# EAGLE design 519_jetson_nano_030001 (EAGLE 9.6.2)
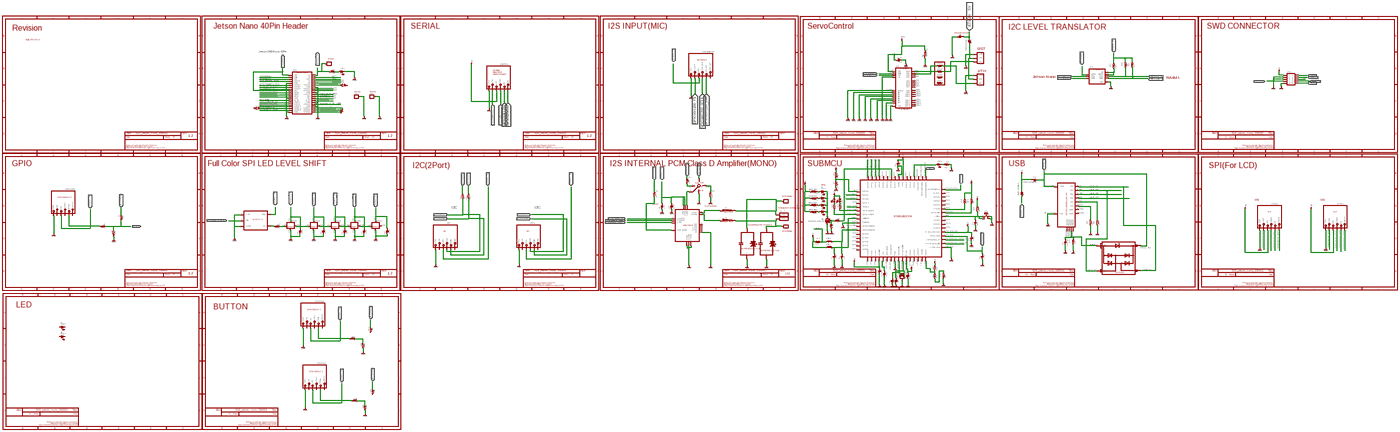
[diagram p0: schematic, sheet 1, overview]
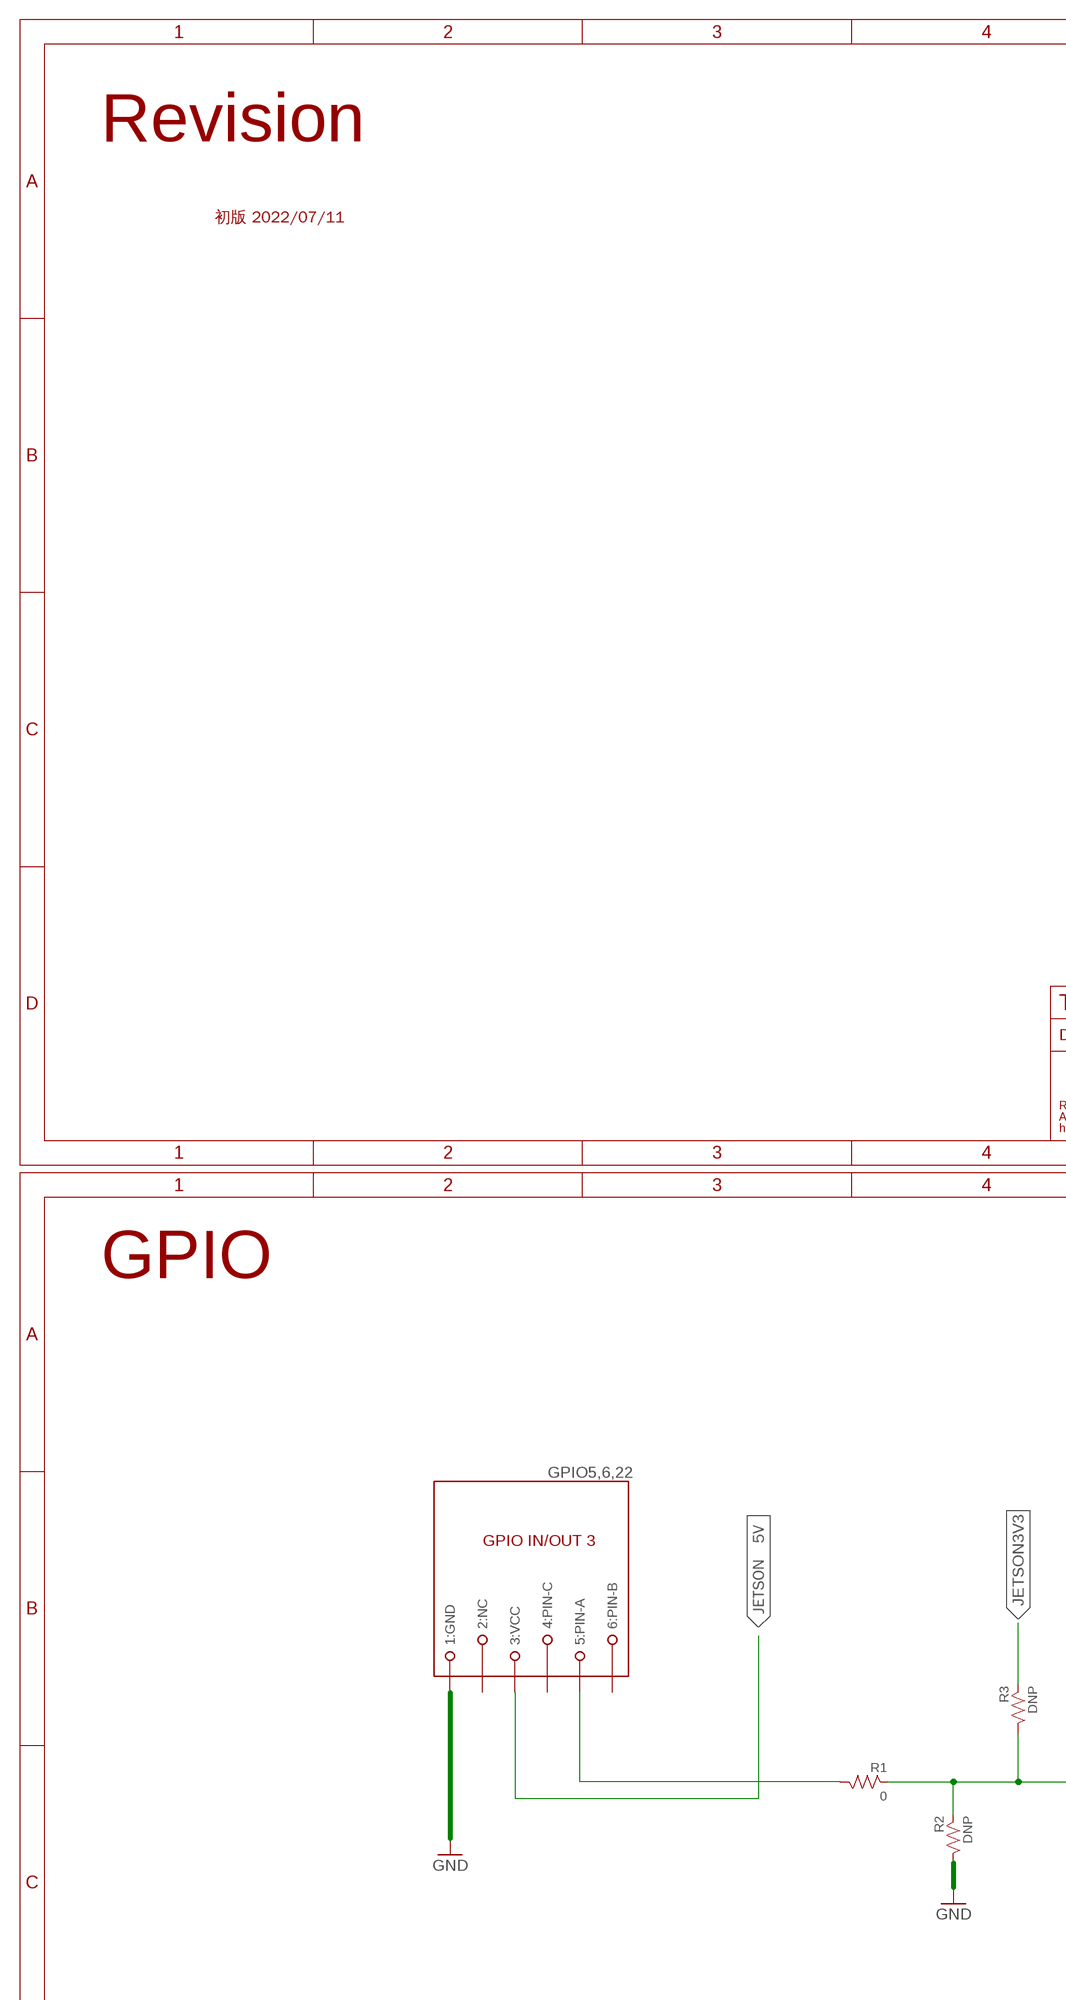
[diagram p1: schematic, sheet 1, part 1 of 8]
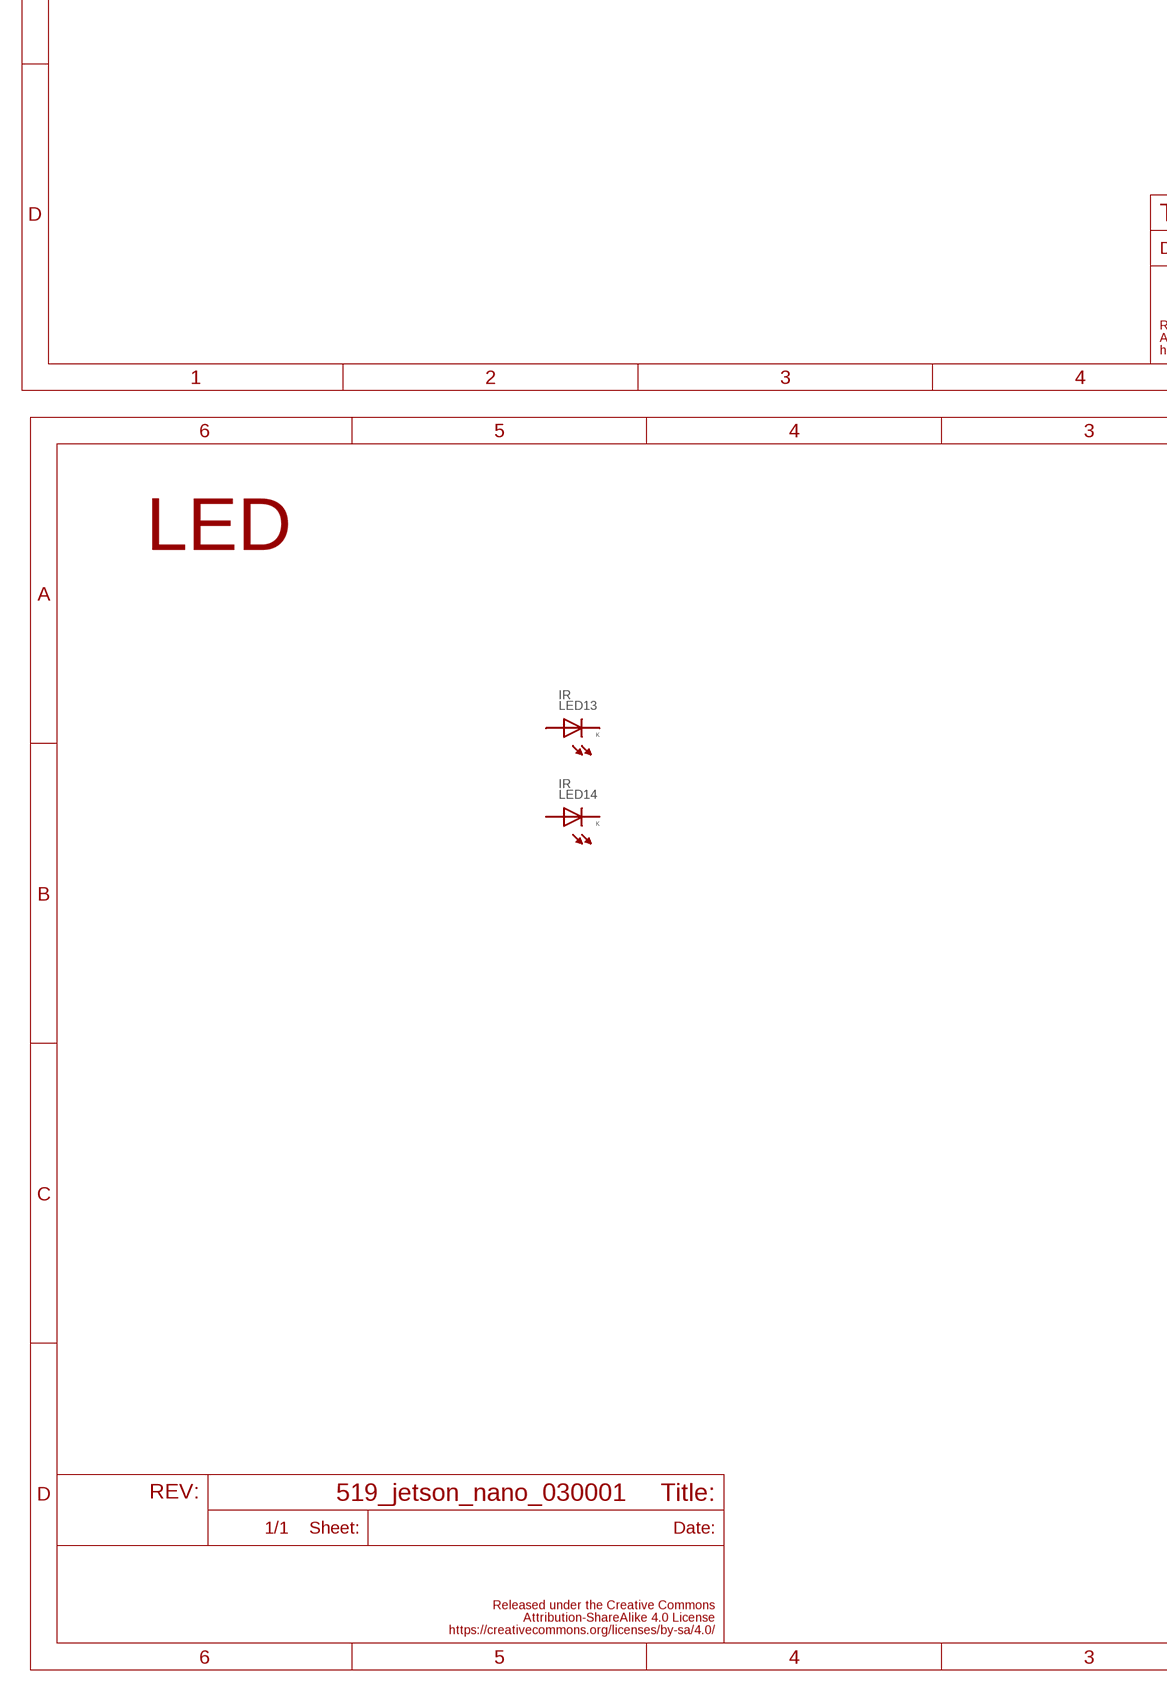
[diagram p2: schematic, sheet 1, part 2 of 8]
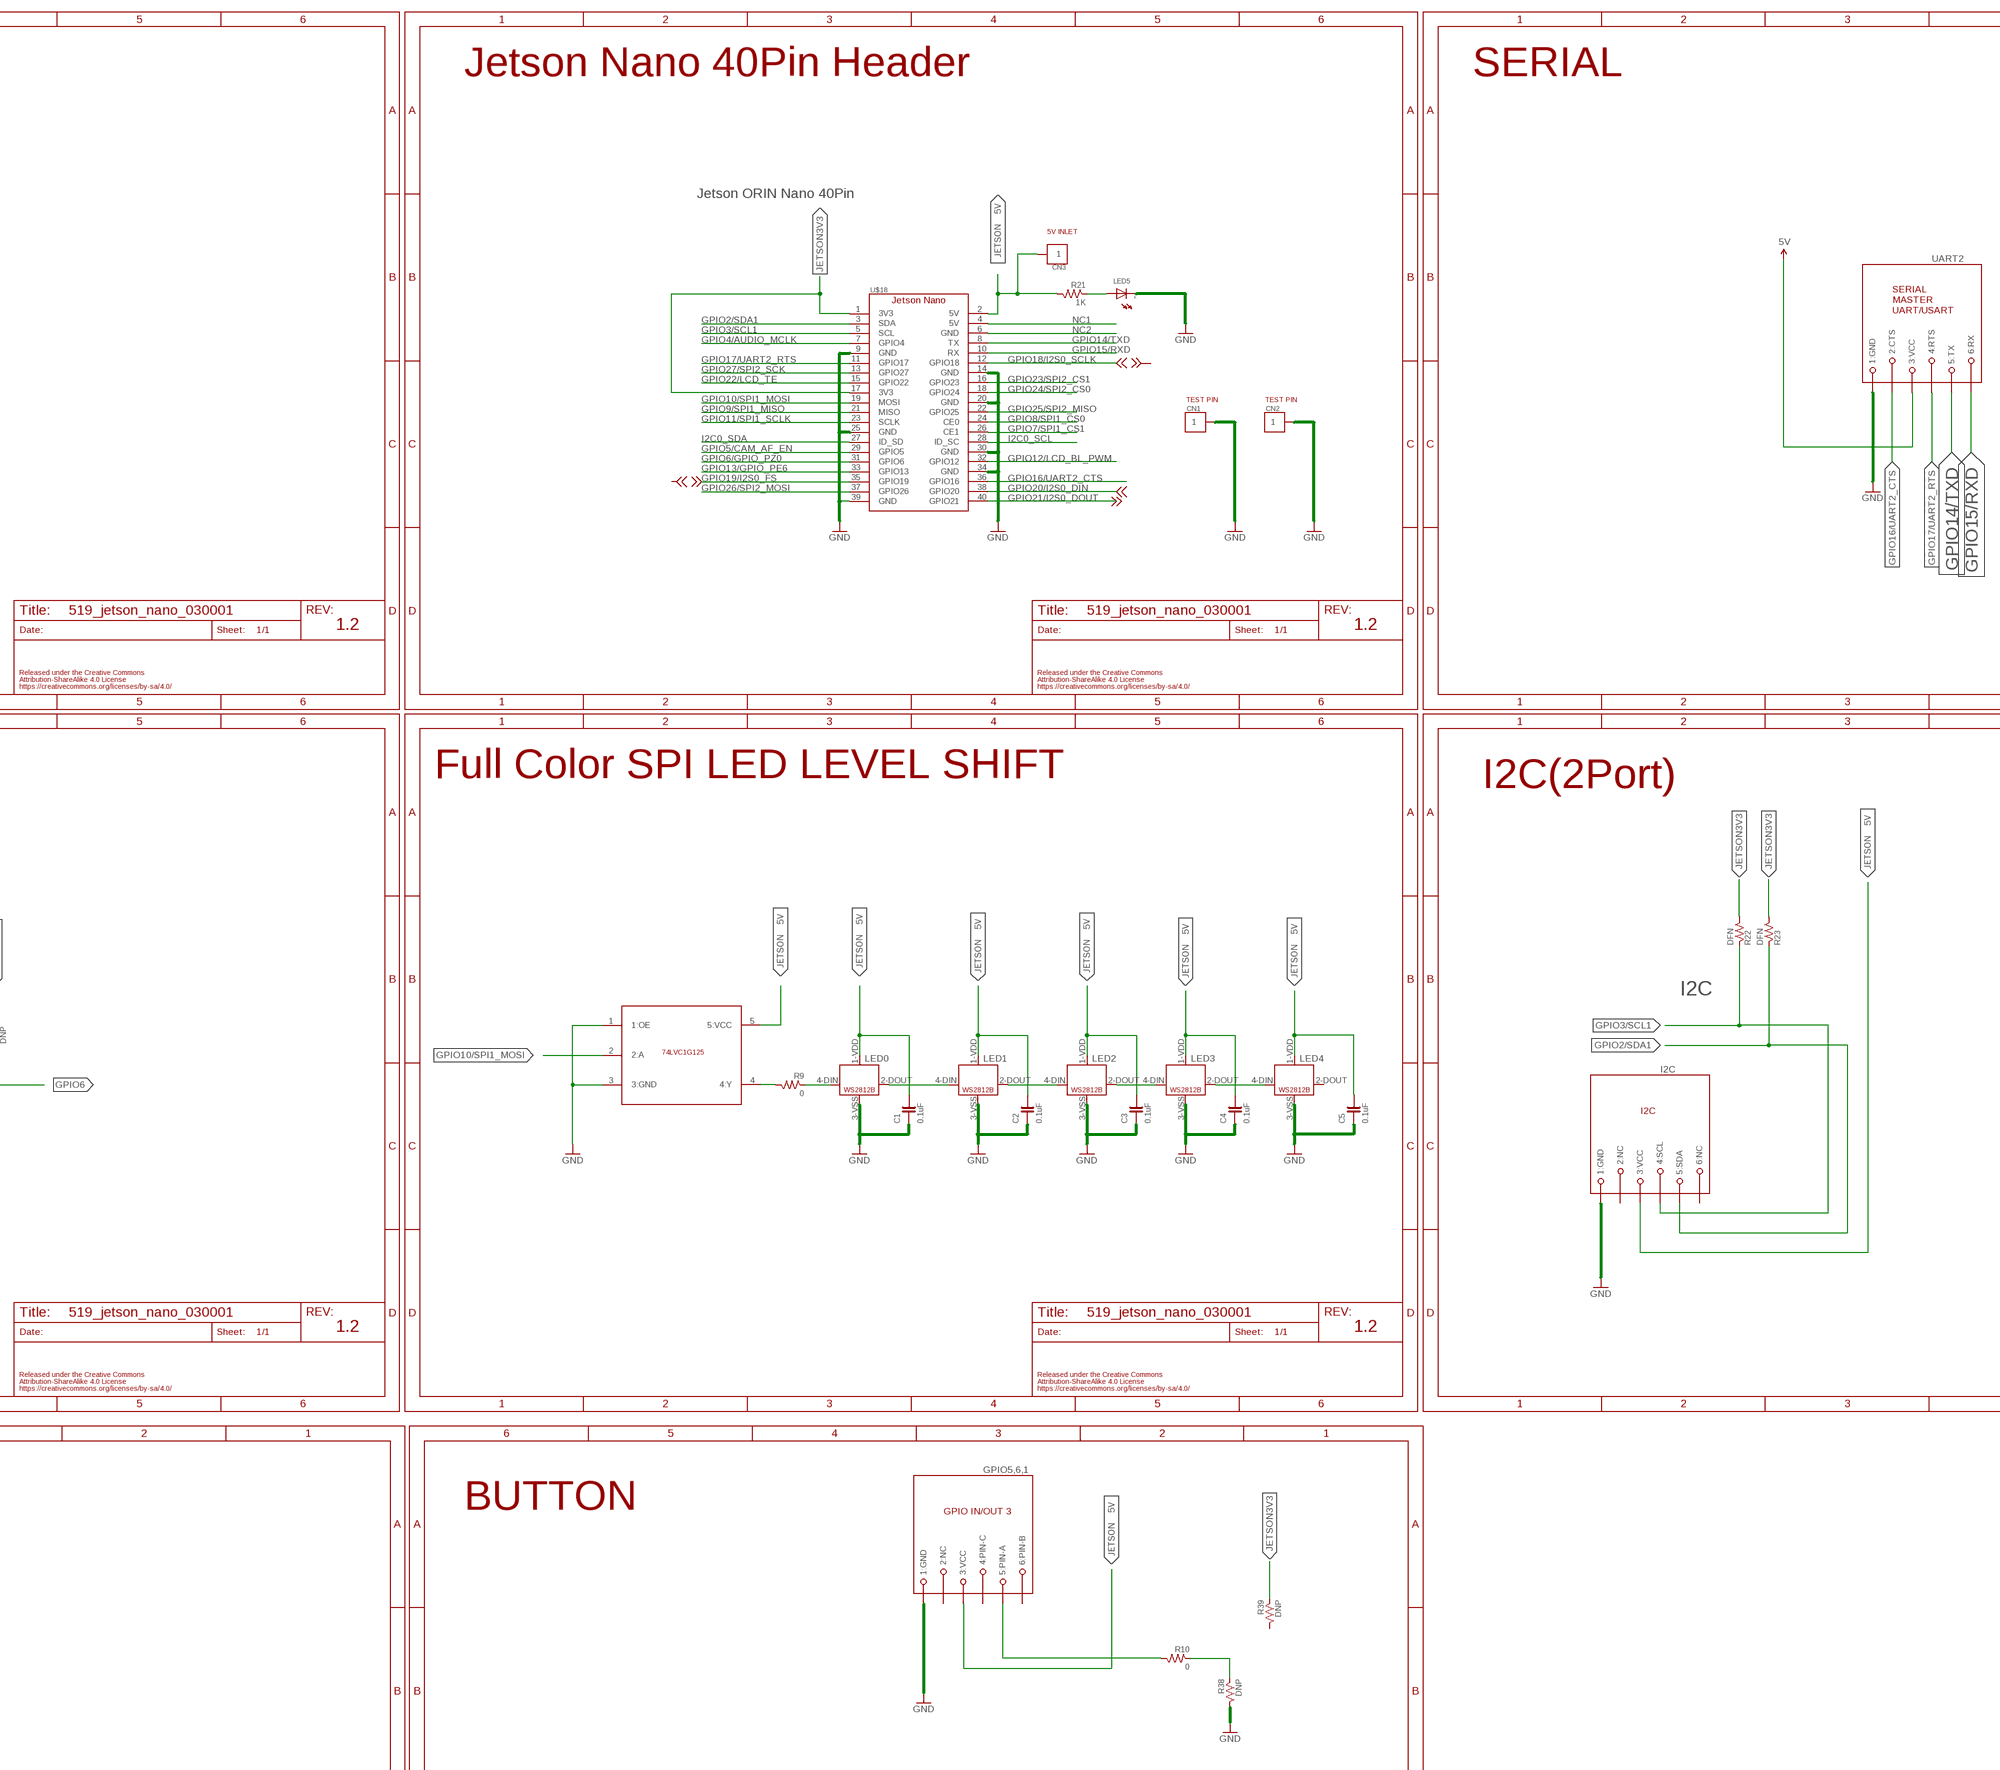
[diagram p3: schematic, sheet 1, part 3 of 8]
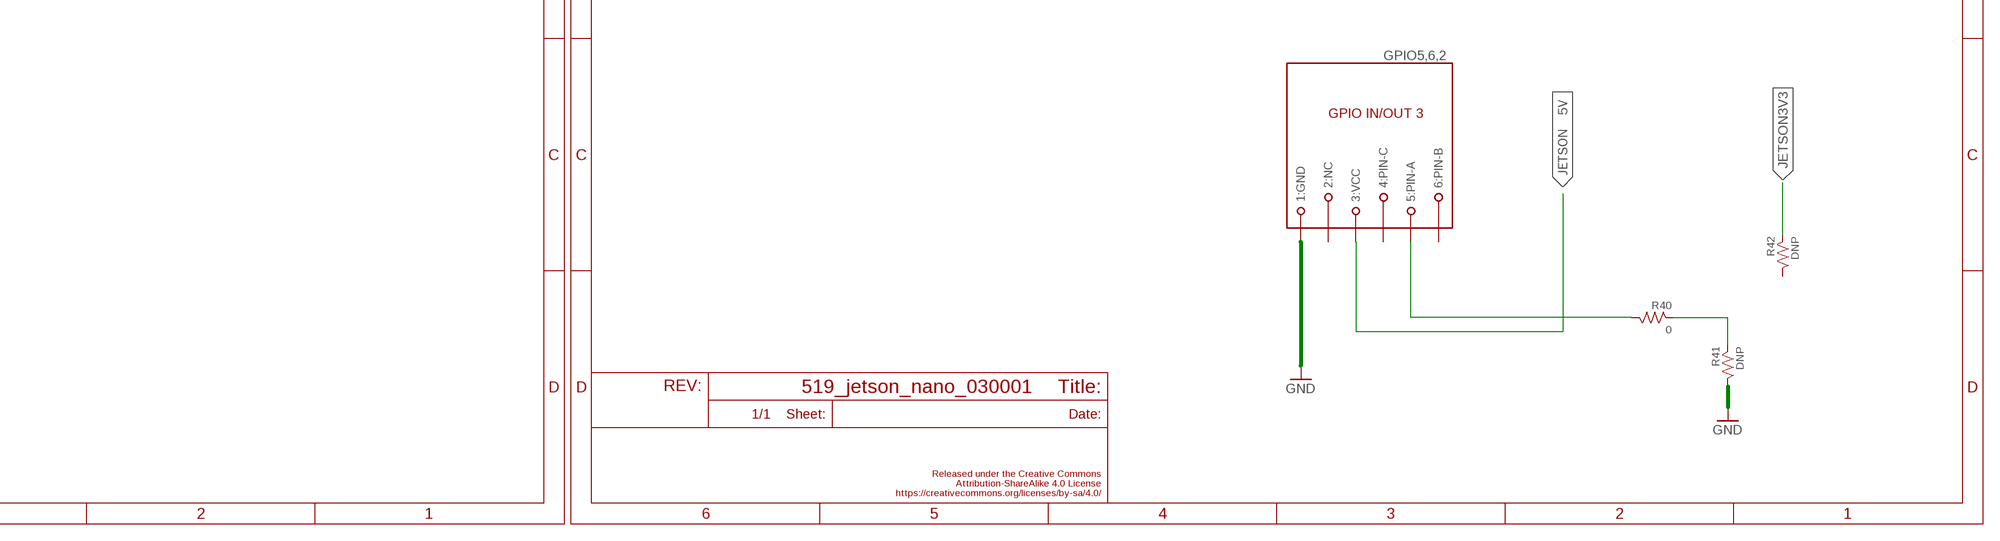
[diagram p4: schematic, sheet 1, part 4 of 8]
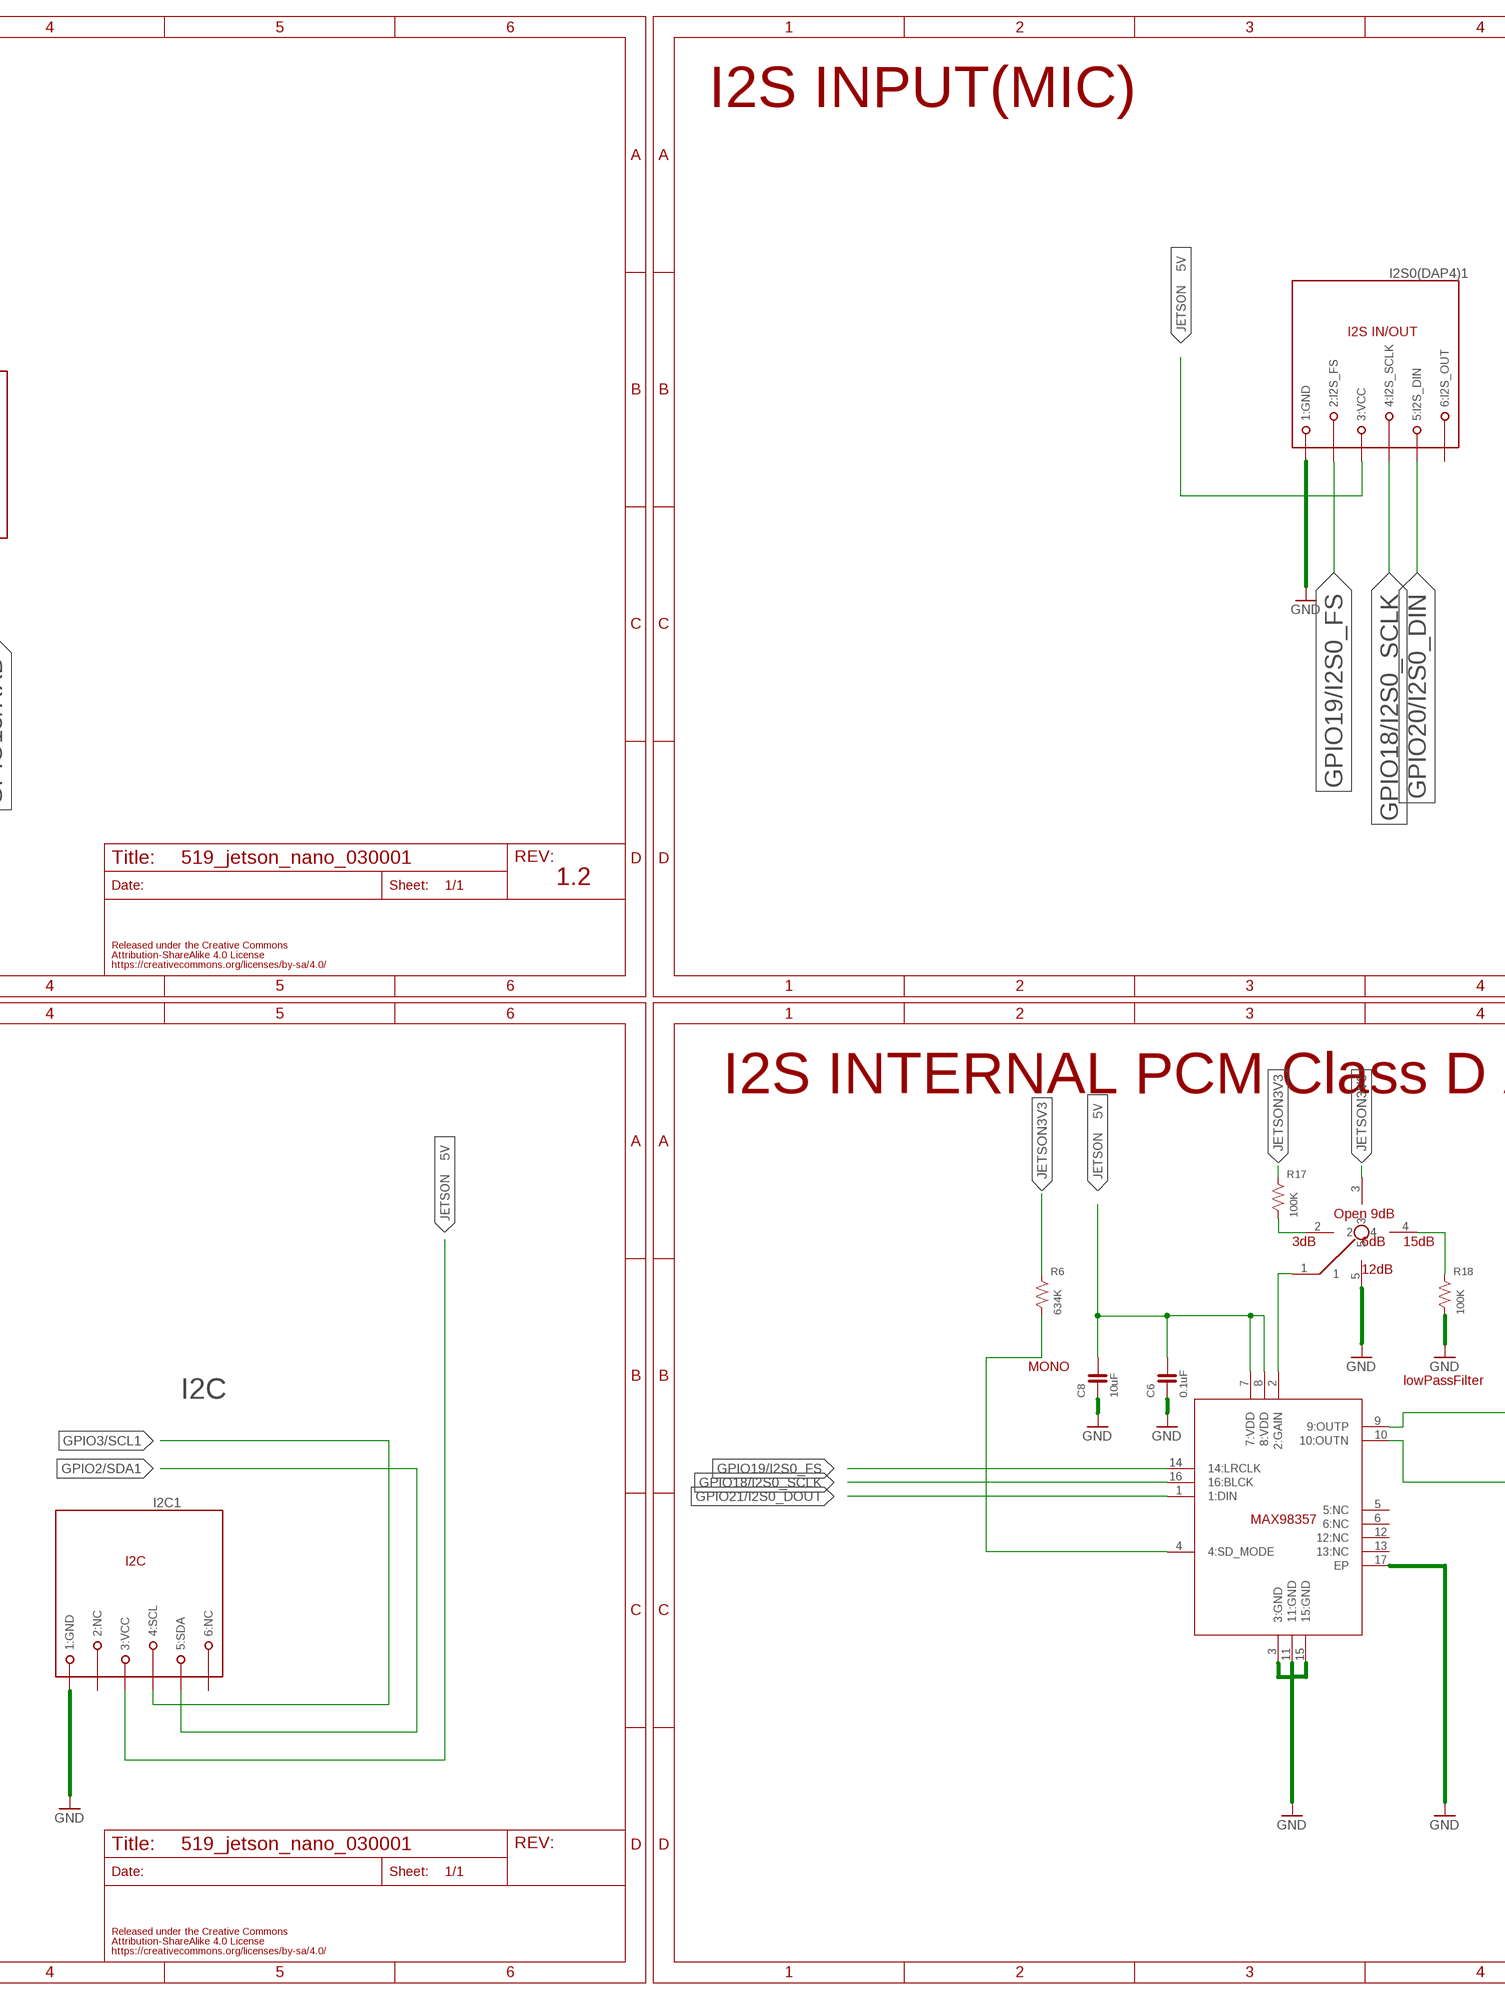
[diagram p5: schematic, sheet 1, part 5 of 8]
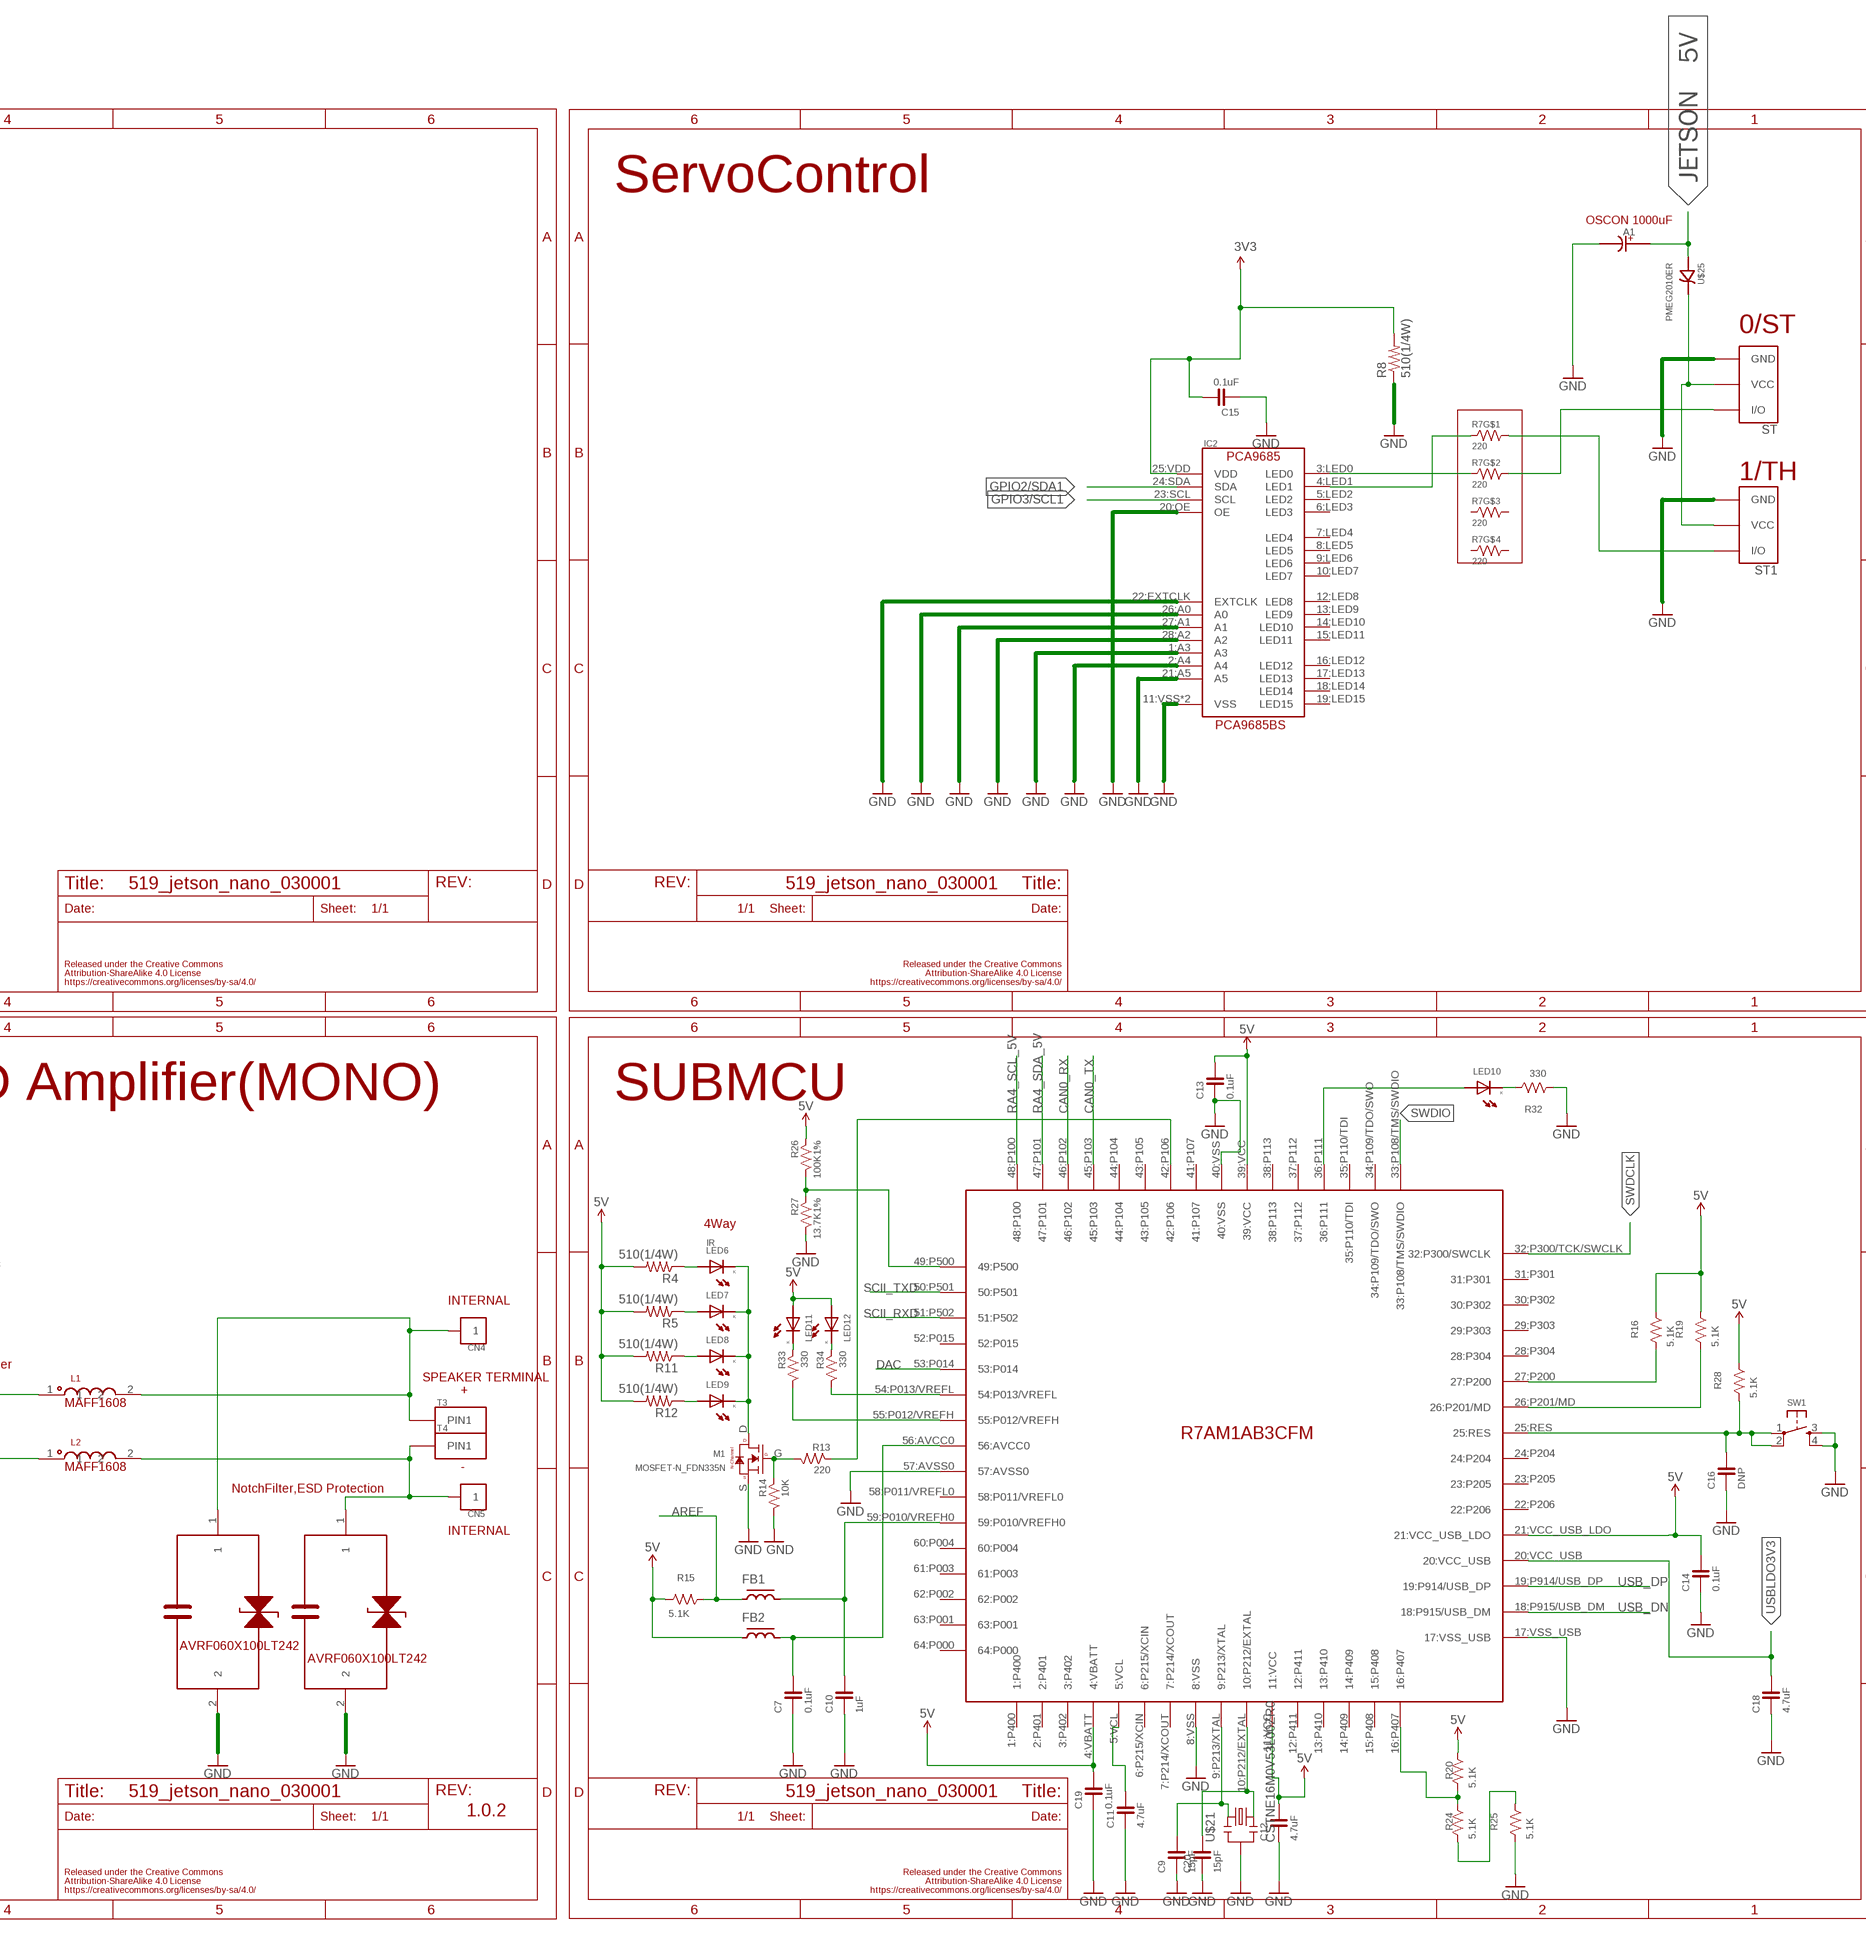
[diagram p6: schematic, sheet 1, part 6 of 8]
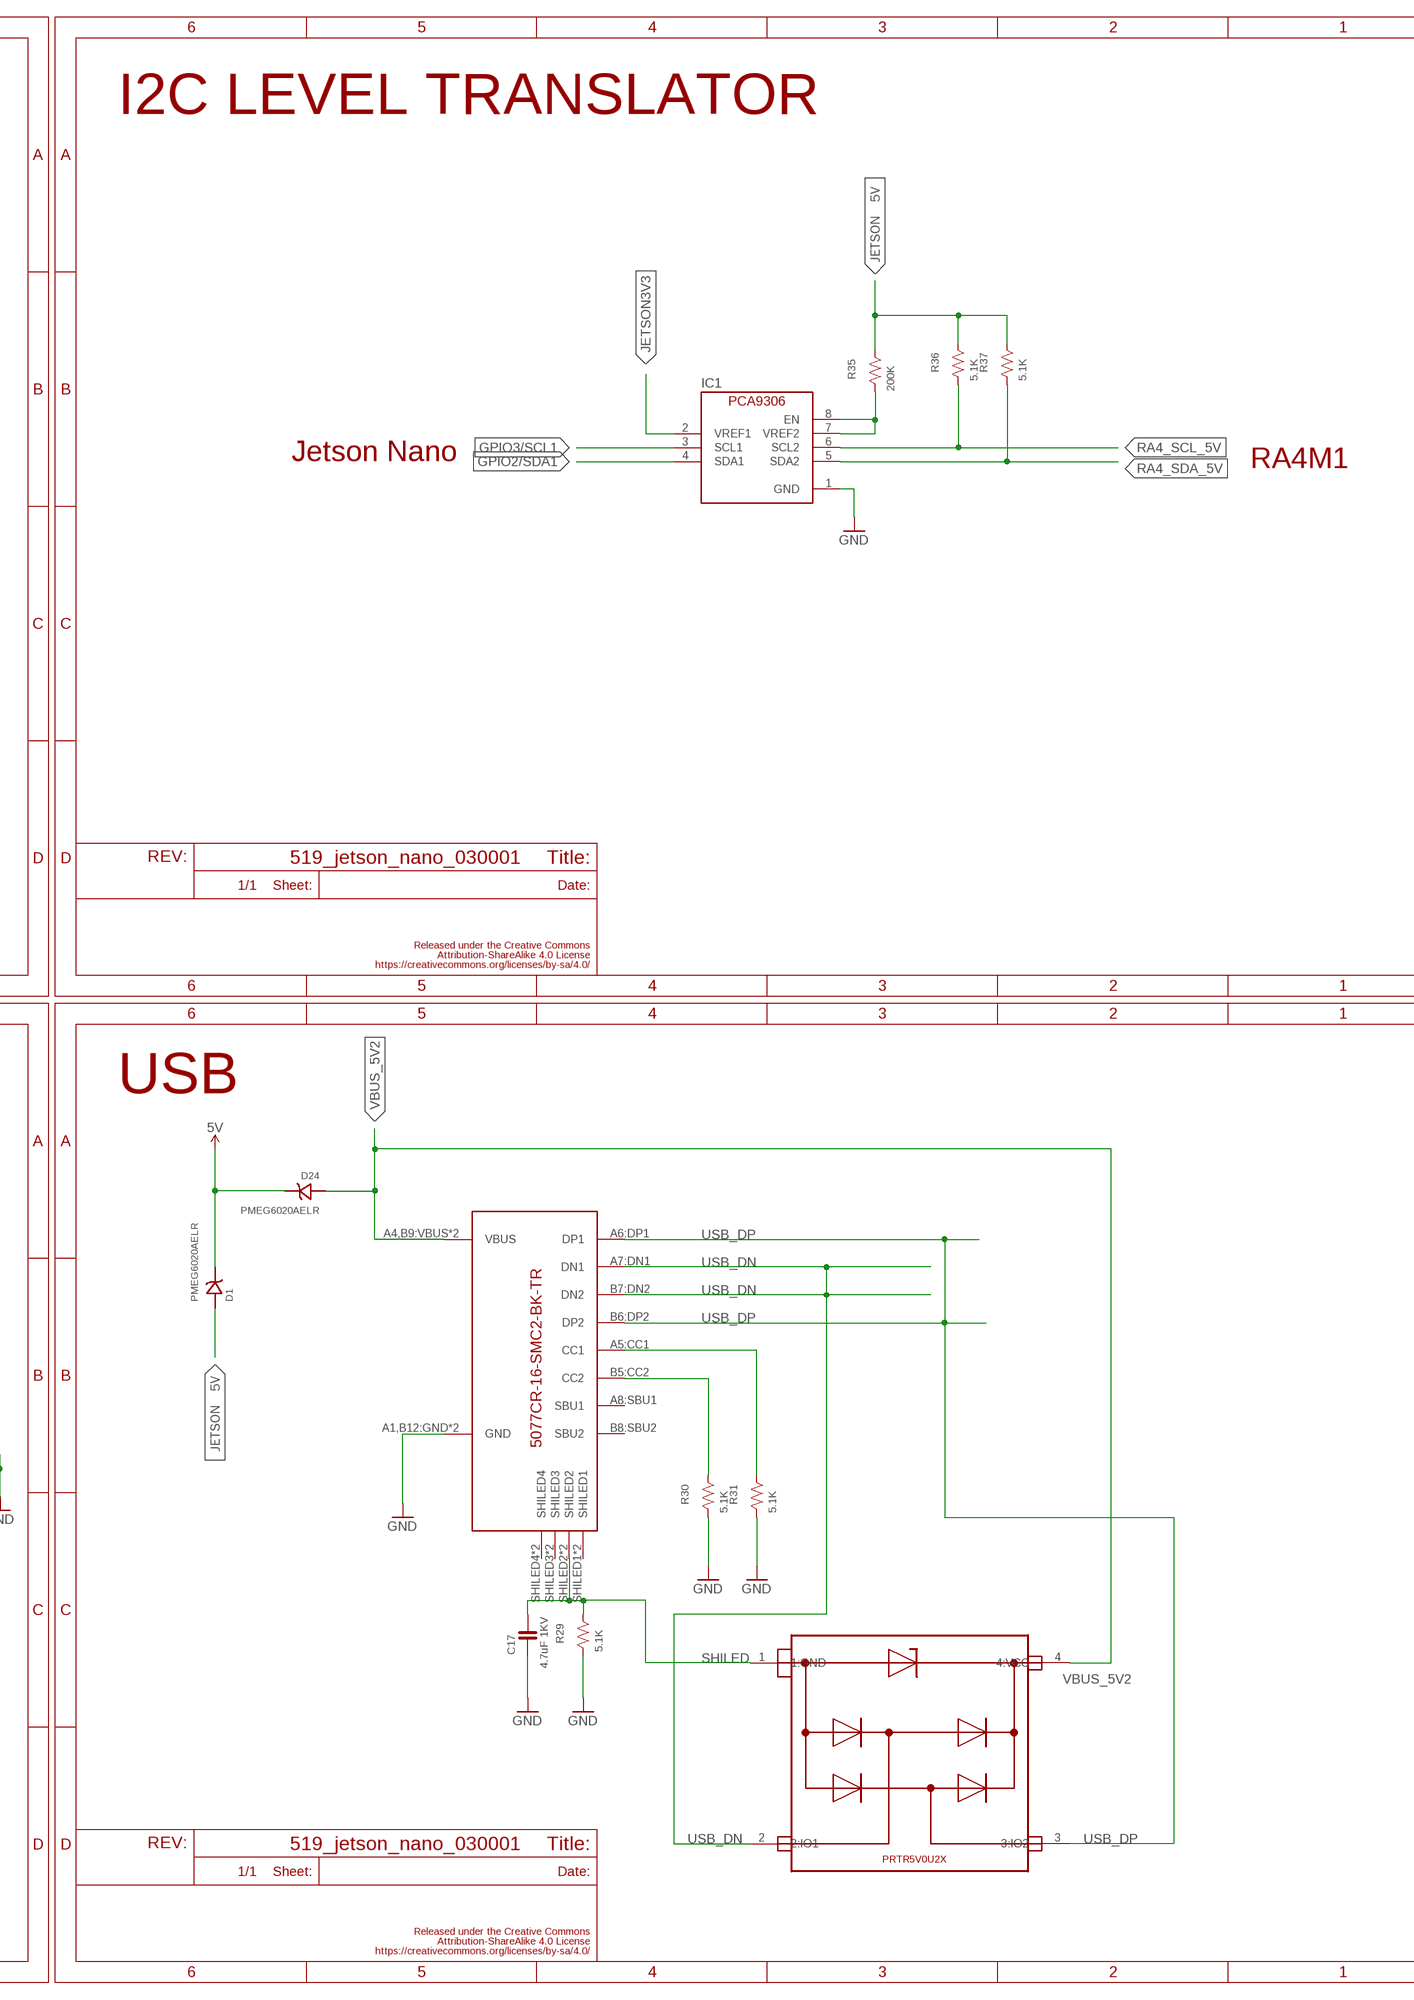
[diagram p7: schematic, sheet 1, part 7 of 8]
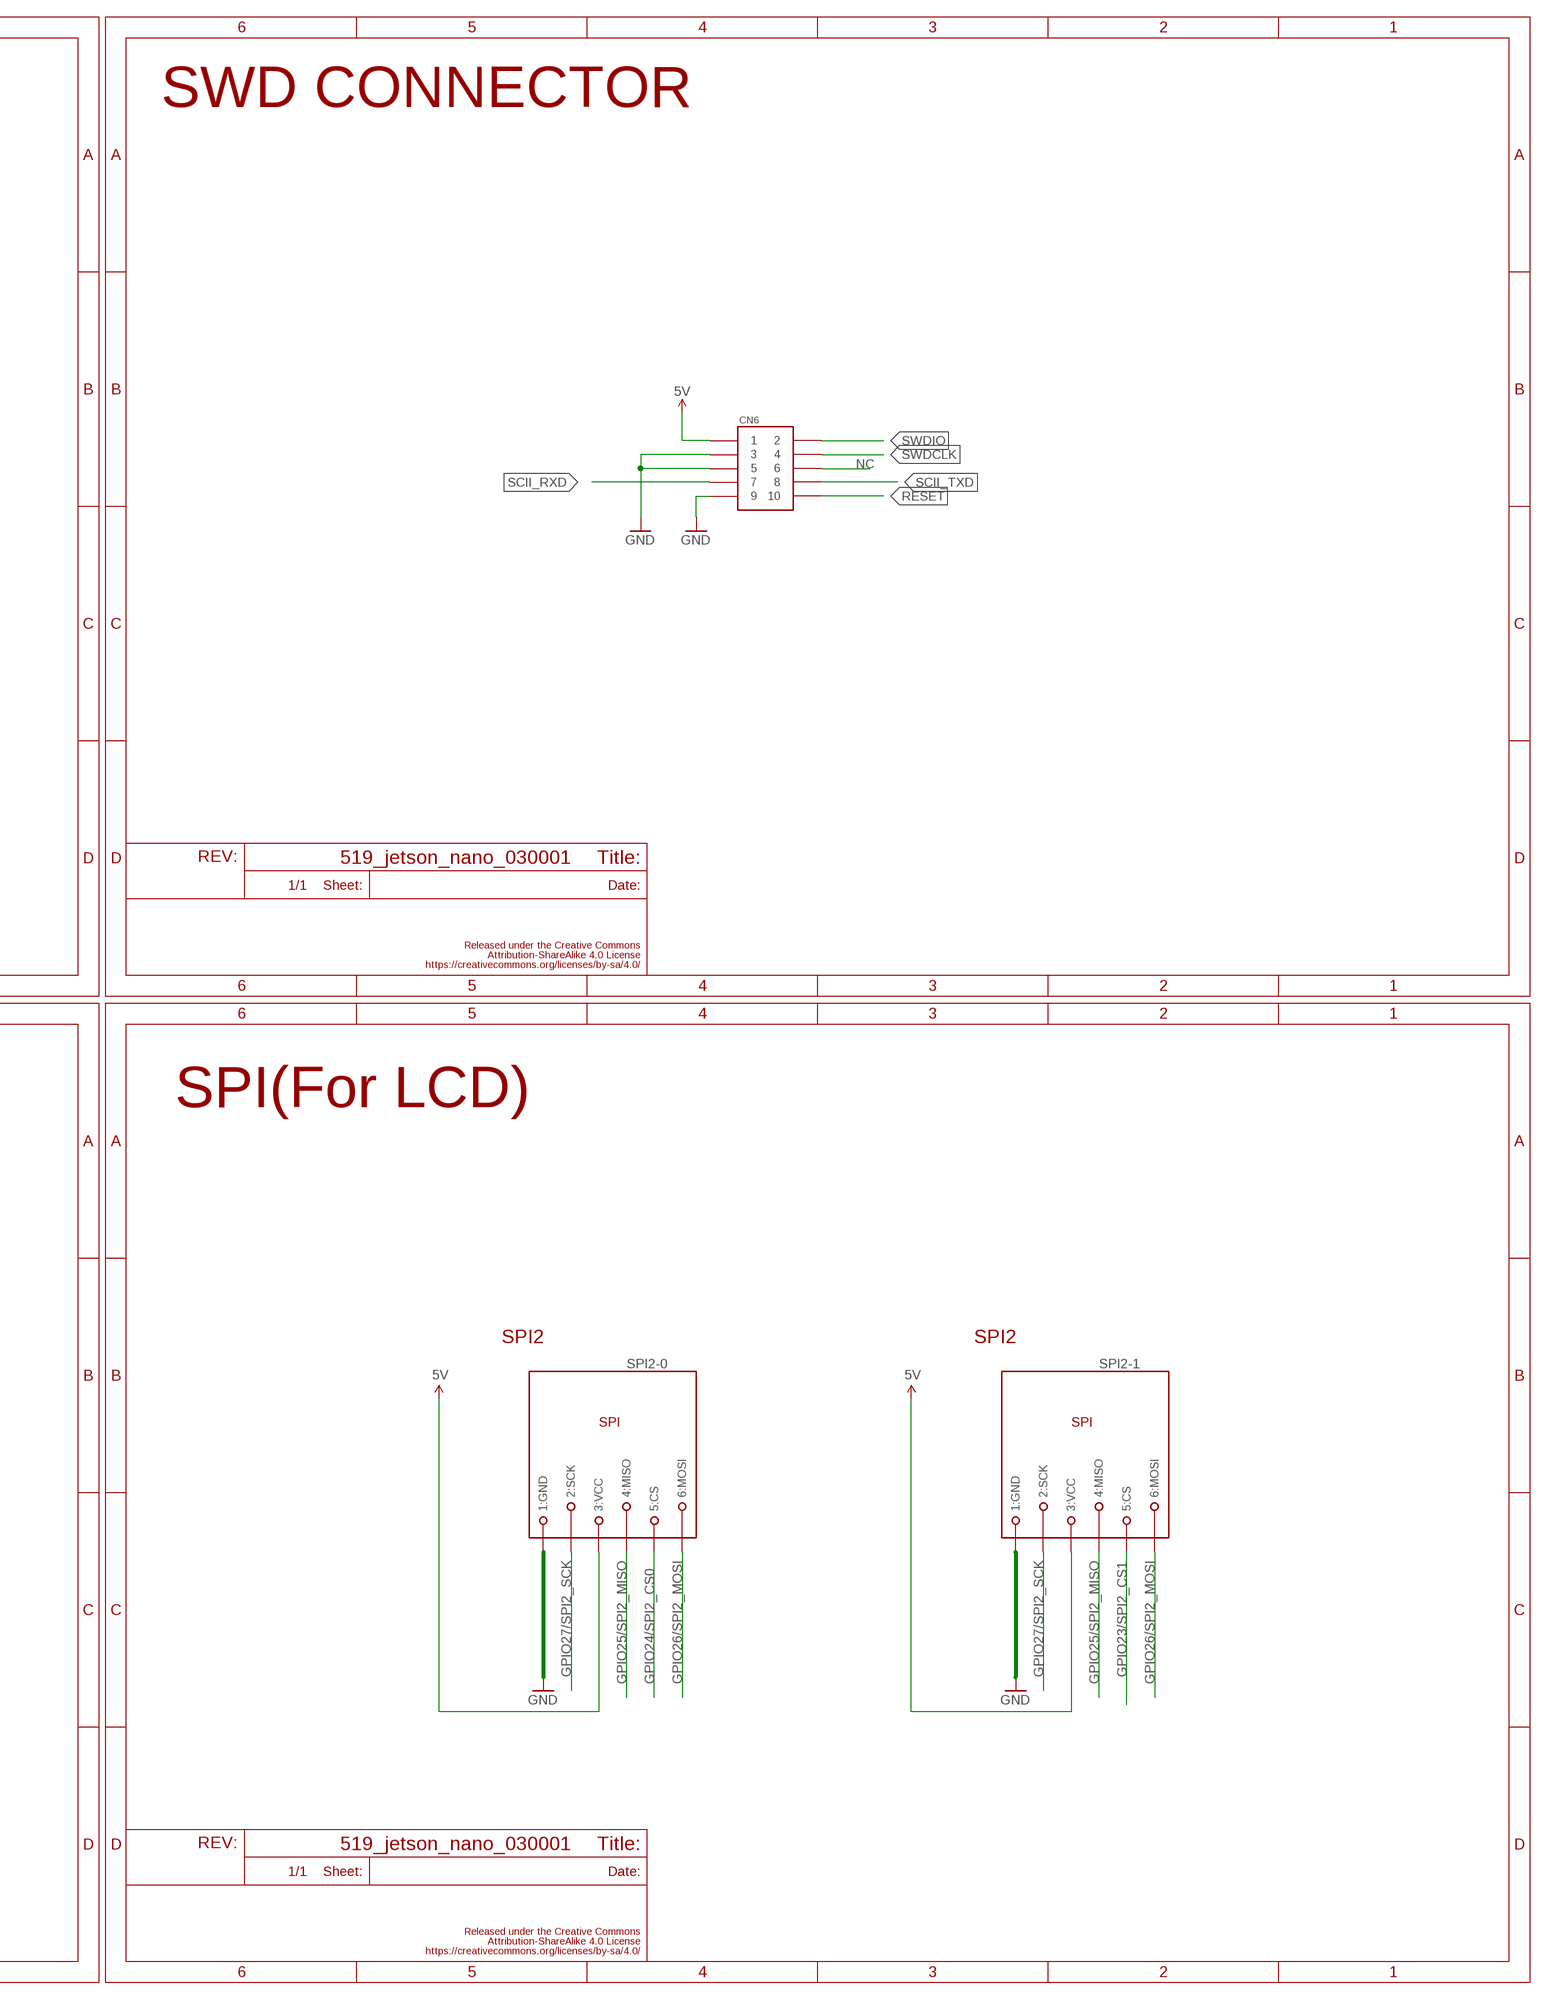
[diagram p8: schematic, sheet 1, part 8 of 8]

## Parts
A1  CAPACITOR-OS-CON  [F13]
C1  0.1uF  CAPACITOR-0603_NARROW  [0603-NARROW]
C2  0.1uF  CAPACITOR-0603_NARROW  [0603-NARROW]
C3  0.1uF  CAPACITOR-0603_NARROW  [0603-NARROW]
C4  0.1uF  CAPACITOR-0603_NARROW  [0603-NARROW]
C5  0.1uF  CAPACITOR-0603_NARROW  [0603-NARROW]
C6  0.1uF  CAPACITOR-0603  [0603]
C7  0.1uF  CAPACITOR-0603  [0603]
C8  10uF  CAPACITOR-0603  [0603]
C9  15pF  CAPACITOR-0603  [0603]
C10  1uF  CAPACITOR-0603  [0603]
C11  4.7uF  CAPACITOR-0603  [0603]
C12  4.7uF  CAPACITOR-0603  [0603]
C13  0.1uF  CAPACITOR-0603  [0603]
C14  0.1uF  CAPACITOR-0603  [0603]
C15  0.1uF  CAPACITOR-0603  [0603]
C16  DNP  CAPACITOR-0603  [0603]
C17  4.7uF 1KV  CAPACITOR-0603  [0603]
C18  4.7uF  CAPACITOR-0603  [0603]
C19  0.1uF  CAPACITOR-0603  [0603]
C20  15pF  CAPACITOR-0603  [0603]
CN1  PIN_1X1-SMALL  [PIN_1X1_SMALL]
CN2  PIN_1X1-SMALL  [PIN_1X1_SMALL]
CN3  PIN_1X1-SMALL  [PIN_1X1_SMALL]
CN4  PIN_1X1-SMALL  [PIN_1X1_SMALL]
CN5  PIN_1X1-SMALL  [PIN_1X1_SMALL]
CN6  PIN-HEADER-SMT(1.27MM)2X5  [PIN-HEADER-SMT(1.27MM)2X5]
D1  PMEG6020AELR  [SOD123W]
D24  PMEG6020AELR  [SOD123W]
FB1  FERRITEBEADS  [0603]
FB2  FERRITEBEADS  [0603]
GPIO5,6,1  MODULAR-JACK-6P-RJ11_GPIO3  [7002-6PXC-X]
GPIO5,6,2  MODULAR-JACK-6P-RJ11_GPIO3  [7002-6PXC-X]
GPIO5,6,22  MODULAR-JACK-6P-RJ11_GPIO3  [7002-6PXC-X]
I2C  MODULAR-JACK-6P-RJ11_I2C  [7002-6PXC-X]
I2C1  MODULAR-JACK-6P-RJ11_I2C  [7002-6PXC-X]
I2S0(DAP4)1  MODULAR-JACK-6P-RJ11_I2S_MASTER  [7002-6PXC-X]
IC1  PCA9306_SSOP  [8PIN-SSOP]
IC2  PCA9685BSPCA9685BS  [HVQFN28]
L1  MAF1608F  [1608MM]
L2  MAF1608F  [1608MM]
LED0  WS2812B_NARROW  [WS2812B_NARROW]
LED1  WS2812B_NARROW  [WS2812B_NARROW]
LED2  WS2812B_NARROW  [WS2812B_NARROW]
LED3  WS2812B_NARROW  [WS2812B_NARROW]
LED4  WS2812B_NARROW  [WS2812B_NARROW]
LED5  LED-0603  [0603]
LED6  IR  LED-5MM  [LED_5MM]
LED7  LED-5MM  [LED_5MM]
LED8  LED-5MM  [LED_5MM]
LED9  LED-5MM  [LED_5MM]
LED10  LED-0603  [0603]
LED11  LED-0603  [0603]
LED12  LED-0603  [0603]
LED13  IR  LED-5MM  [LED_5MM]
LED14  IR  LED-5MM  [LED_5MM]
M1  MOSFET-N_FDN335N  [SUPERSOT-3]
R1  0  RESISTOR-0603  [0603]
R2  DNP  RESISTOR-0603  [0603]
R3  DNP  RESISTOR-0603  [0603]
R4  510(1/4W)  R-US_R0805  [R0805]
R5  510(1/4W)  R-US_R0805  [R0805]
R6  634K  RESISTOR-0603  [0603]
R7  220  RESISTOR_ARRAY  [EXBV8V]
R8  510(1/4W)  R-US_R0805  [R0805]
R9  0  RESISTOR-0603  [0603]
R10  0  RESISTOR-0603  [0603]
R11  510(1/4W)  R-US_R0805  [R0805]
R12  510(1/4W)  R-US_R0805  [R0805]
R13  220  RESISTOR-0603  [0603]
R14  10K  RESISTOR-0603  [0603]
R15  5.1K  RESISTOR-0603  [0603]
R16  5.1K  RESISTOR-0603  [0603]
R17  100K  RESISTOR-0603  [0603]
R18  100K  RESISTOR-0603  [0603]
R19  5.1K  RESISTOR-0603  [0603]
R20  5.1K  RESISTOR-0603  [0603]
R21  1K  RESISTOR-0603  [0603]
R22  DFN  RESISTOR-0603  [0603]
R23  DFN  RESISTOR-0603  [0603]
R24  5.1K  RESISTOR-0603  [0603]
R25  5.1K  RESISTOR-0603  [0603]
R26  100K1%  RESISTOR-0603  [0603]
R27  13.7K1%  RESISTOR-0603  [0603]
R28  5.1K  RESISTOR-0603  [0603]
R29  5.1K  RESISTOR-0603  [0603]
R30  5.1K  RESISTOR-0603  [0603]
R31  5.1K  RESISTOR-0603  [0603]
R32  330  RESISTOR-0603  [0603]
R33  330  RESISTOR-0603  [0603]
R34  330  RESISTOR-0603  [0603]
R35  200K  RESISTOR-0603  [0603]
R36  5.1K  RESISTOR-0603  [0603]
R37  5.1K  RESISTOR-0603  [0603]
R38  DNP  RESISTOR-0603  [0603]
R39  DNP  RESISTOR-0603  [0603]
R40  0  RESISTOR-0603  [0603]
R41  DNP  RESISTOR-0603  [0603]
R42  DNP  RESISTOR-0603  [0603]
SPI2-0  MODULAR-JACK-6P-RJ11_SPI  [7002-6PXC-X]
SPI2-1  MODULAR-JACK-6P-RJ11_SPI  [7002-6PXC-X]
ST  FABO_BRICK_3PIN-HEADER  [FABO_BRICK_3PIN_HEADER]
ST1  FABO_BRICK_3PIN-HEADER  [FABO_BRICK_3PIN_HEADER]
SW1  TACT-SWITCH-SMD_KMR2  [KMR2]
T3  TBL004-508  [TBL004-508]
T4  TBL004-508  [TBL004-508]
U$11  AVRF060X100LT242  [AVRF0X0X100LT_0603]
U$12  AVRF060X100LT242  [AVRF0X0X100LT_0603]
U$13  MAX98357A,B  [TQFN(16L3*3*0.75)]
U$14  2MMJUMPER_CROSS  [PINHEAD2MM_CROSS]
U$18  JETSON_NANOJETSON_NANO_OVERALL  [JETSON_NANO_DEMENTION]
U$19  R7FA4M1AB3CFM  [LQFP-64_RENESAS]
U$21  CSTNE16M0V53L00ZR0  [3-SMD]
U$22  5077CR-16-SMC2-BK-TR  [5077CR-16-SMC2-BK-TR]
U$23  PRTR5V0U2X  [SOT143B]
U$25  PMEG2010ER  [SOD123W]
U$28  74LVC1G125  [TSOP5(SOT753)]
UART2  MODULAR-JACK-6P-RJ11_SERIAL_M_USART  [7002-6PXC-X]

## Nets
3DB: R17.2 U$14.2
3V3: C15.2 IC2.25:VDD(VDD) R8.2
5V: C12.2 C13.2 C14.2 C19.2 CN6.1 D1.1(CATHODE) D24.1(CATHODE) FB2.1 LED11.ANODE LED12.ANODE R4.2 R5.2 R11.2 R12.2 R15.2 R16.1 R19.1 R20.1 R26.1 R28.1 SPI2-0.3(3:VCC) SPI2-1.3(3:VCC) U$19.4:VBATT U$19.11:VCC U$19.21:VCC_USB_LDO U$19.39:VCC UART2.3(3:VCC)
15DB: R18.1 U$14.4
AREF: FB1.1 R15.1
CAN0_RX: U$19.46:P102
CAN0_TX: U$19.45:P103
DAC: U$19.53:P014
G1: GPIO5,6,1.5(5:PIN-A) R10.2
G2: GPIO5,6,2.5(5:PIN-A) R40.2
G6: GPIO5,6,22.5(5:PIN-A) R1.2
GAIN: U$13.2(2:GAIN) U$14.1
GND [New Class]: A1.CATHODE(-) C1.1 C2.1 C3.1 C4.1 C5.1 C6.1 C7.1 C8.1 C9.1 C10.1 C11.1 C12.1 C13.1 C14.1 C15.1 C16.1 C17.1 C18.1 C19.1 C20.1 CN1.1 CN2.1 CN6.3 CN6.5 CN6.9 GPIO5,6,1.1(1:GND) GPIO5,6,2.1(1:GND) GPIO5,6,22.1(1:GND) I2C1.1(1:GND) I2C.1(1:GND) I2S0(DAP4)1.1(1:GND) IC1.1(GND) IC2.1:A3(A3) IC2.2:A4(A4) IC2.11:VSS(VSS) IC2.20:OE(OE) IC2.21:A5(A5) IC2.22:EXTCLK(EXTCLK) IC2.26:A0(A0) IC2.27:A1(A1) IC2.28:A2(A2) IC2.29(VSS) LED0.3-VSS(VSS) LED1.3-VSS(VSS) LED2.3-VSS(VSS) LED3.3-VSS(VSS) LED4.3-VSS(VSS) LED5.CATHODE M1.S R2.2 R8.1 R14.2 R18.2 R25.2 R27.2 R29.2 R30.2 R31.2 R32.2 R38.2 R41.2 SPI2-0.1(1:GND) SPI2-1.1(1:GND) ST1.GND ST.GND SW1.3 SW1.4 U$11.2 U$12.2 U$13.3(3:GND) U$13.11(11:GND) U$13.15(15:GND) U$13.17(EP) U$14.5 U$18.9(GND) U$18.14(GND) U$18.20(GND) U$18.25(GND) U$18.30(GND) U$18.34(GND) U$18.39(GND) U$19.8:VSS U$19.17:VSS_USB U$19.40:VSS U$19.57:AVSS0 U$21.2:GND U$22.A1,B12:GND(GND) U$22.B1,A12:GND(GND) U$28.1(1:OE) U$28.3(3:GND) UART2.1(1:GND)
GPIO2/SDA1 [New Class]: I2C1.5(5:SDA) I2C.5(5:SDA) IC1.4(SDA1) IC2.24:SDA(SDA) R23.1 U$18.3(SDA)
GPIO3/SCL1 [New Class]: I2C1.4(4:SCL) I2C.4(4:SCL) IC1.3(SCL1) IC2.23:SCL(SCL) R22.1 U$18.5(SCL)
GPIO4/AUDIO_MCLK [New Class]: U$18.7(GPIO4)
GPIO5/CAM_AF_EN [New Class]: U$18.29(GPIO5)
GPIO6: R1.1 R2.1 R3.2 R10.1 R38.1 R40.1 R41.1
GPIO6/GPIO_PZ0 [New Class]: U$18.31(GPIO6)
GPIO7/SPI1_CS1 [New Class]: U$18.26(CE1)
GPIO8/SPI1_CS0 [New Class]: U$18.24(CE0)
GPIO9/SPI1_MISO [New Class]: U$18.21(MISO)
GPIO10/SPI1_MOSI [New Class]: U$18.19(MOSI) U$28.2(2:A)
GPIO11/SPI1_SCLK [New Class]: U$18.23(SCLK)
GPIO12/LCD_BL_PWM [New Class]: U$18.32(GPIO12)
GPIO13/GPIO_PE6 [New Class]: U$18.33(GPIO13)
GPIO14/TXD [New Class]: U$18.8(TX) UART2.5(5:TX)
GPIO15/RXD [New Class]: U$18.10(RX) UART2.6(6:RX)
GPIO16/UART2_CTS [New Class]: U$18.36(GPIO16) UART2.2(2:CTS)
GPIO17/UART2_RTS [New Class]: U$18.11(GPIO17) UART2.4(4:RTS)
GPIO18/I2S0_SCLK [New Class]: I2S0(DAP4)1.4(4:I2S_SCLK) U$13.16(16:BLCK) U$18.12(GPIO18)
GPIO19/I2S0_FS [New Class]: I2S0(DAP4)1.2(2:I2S_FS) U$13.14(14:LRCLK) U$18.35(GPIO19)
GPIO20/I2S0_DIN [New Class]: I2S0(DAP4)1.5(5:I2S_DIN) U$18.38(GPIO20)
GPIO21/I2S0_DOUT [New Class]: U$13.1(1:DIN) U$18.40(GPIO21)
GPIO22/LCD_TE [New Class]: U$18.15(GPIO22)
GPIO23/SPI2_CS1 [New Class]: SPI2-1.5(5:CS) U$18.16(GPIO23)
GPIO24/SPI2_CS0 [New Class]: SPI2-0.5(5:CS) U$18.18(GPIO24)
GPIO25/SPI2_MISO [New Class]: SPI2-0.4(4:MISO) SPI2-1.4(4:MISO) U$18.22(GPIO25)
GPIO26/SPI2_MOSI [New Class]: SPI2-0.6(6:MOSI) SPI2-1.6(6:MOSI) U$18.37(GPIO26)
GPIO27/SPI2_SCK [New Class]: SPI2-0.2(2:SCK) SPI2-1.2(2:SCK) U$18.13(GPIO27)
I2C0_SCL [New Class]: U$18.28(ID_SC)
I2C0_SDA [New Class]: U$18.27(ID_SD)
JETSON3V3 [New Class]: IC1.2(VREF1) R3.1 R6.1 R17.1 R22.2 R23.2 R39.1 R42.1 U$14.3 U$18.1(3V3) U$18.17(3V3)
JETSON　5V [New Class]: A1.ANODE(+) C1.2 C2.2 C3.2 C4.2 C5.2 C6.2 C8.2 CN3.1 D1.2(ANODE) GPIO5,6,1.3(3:VCC) GPIO5,6,2.3(3:VCC) GPIO5,6,22.3(3:VCC) I2C1.3(3:VCC) I2C.3(3:VCC) I2S0(DAP4)1.3(3:VCC) LED0.1-VDD(VDD) LED1.1-VDD(VDD) LED2.1-VDD(VDD) LED3.1-VDD(VDD) LED4.1-VDD(VDD) R21.2 R35.1 R36.1 R37.1 U$13.7(7:VDD) U$13.8(8:VDD) U$18.2(5V) U$25.2(ANODE) U$28.5(5:VCC)
MONO: R6.2 U$13.4(4:SD_MODE)
N$1: LED0.2-DOUT(DOUT) LED1.4-DIN(DIN)
N$2: LED6.A(ANODE) R4.1
N$3: LED8.A(ANODE) R11.1
N$4: LED9.A(ANODE) R12.1
N$5: LED5.ANODE R21.1
N$6: LED1.2-DOUT(DOUT) LED2.4-DIN(DIN)
N$7: IC2.4:LED1(LED1) R7.1
N$8: LED2.2-DOUT(DOUT) LED3.4-DIN(DIN)
N$9: LED3.2-DOUT(DOUT) LED4.4-DIN(DIN)
N$10: IC2.3:LED0(LED0) R7.2
N$11: LED6.K(CATHODE) LED7.K(CATHODE) LED8.K(CATHODE) LED9.K(CATHODE) M1.D
N$12: R7.7 ST.I/O
N$13: R7.8 ST1.I/O
N$14: M1.G R13.2 R14.1
N$15: R13.1 U$19.42:P106
N$16: LED7.A(ANODE) R5.1
N$17: R9.2 U$28.4(4:Y)
N$18: C9.2 U$19.9:P213/XTAL U$21.1:INPUT
N$19: C10.2 FB1.2 U$19.59:P010/VREFH0
N$20: C7.2 FB2.2 U$19.56:AVCC0
N$21: C20.2 U$19.10:P212/EXTAL U$21.3:OUTPUT
N$22: C11.2 U$19.5:VCL
N$23: R16.2 U$19.27:P200
N$24: R19.2 U$19.26:P201/MD
N$25: R24.2 R25.1
N$26: R20.2 R24.1 U$19.16:P407
N$27: ST1.VCC ST.VCC U$25.1(CATHODE)
N$28: R26.2 R27.1 U$19.49:P500
N$29: LED0.4-DIN(DIN) R9.1
N$30: R30.1 U$22.B5:CC2(CC2)
N$31: R31.1 U$22.A5:CC1(CC1)
N$32: LED10.CATHODE R32.1
N$33: LED10.ANODE U$19.36:P111
N$34: R34.2 U$19.54:P013/VREFL
N$35: R33.2 U$19.55:P012/VREFH
N$36: LED11.CATHODE R33.1
N$37: LED12.CATHODE R34.1
N$38: IC1.7(VREF2) IC1.8(EN) R35.2
NC: CN6.6
NC1 [New Class]: U$18.4(5V)
NC2 [New Class]: U$18.6(GND)
OUTN: L2.1 U$13.10(10:OUTN)
OUTP: L1.1 U$13.9(9:OUTP)
RA4_SCL_5V: IC1.6(SCL2) R36.2 U$19.48:P100
RA4_SDA_5V: IC1.5(SDA2) R37.2 U$19.47:P101
RESET: C16.2 CN6.10 R28.2 SW1.1 SW1.2 U$19.25:RES
SCII_RXD: CN6.7 U$19.51:P502
SCII_TXD: CN6.8 U$19.50:P501
SHILED: C17.2 R29.1 U$22.SHILED2 U$22.SHILED6(SHILED2) U$23.1(1:GND)
SP_MINUS: CN5.1 L2.2 T4.P$1(PIN1) T4.P$2(PIN1) U$12.1
SP_PLUS: CN4.1 L1.2 T3.P$1(PIN1) T3.P$2(PIN1) U$11.1
SWDCLK: CN6.4 U$19.32:P300/TCK/SWCLK(32:P300/SWCLK)
SWDIO: CN6.2 U$19.33:P108/TMS/SWDIO
USB_DN: U$19.18:P915/USB_DM U$22.A7:DN1(DN1) U$22.B7:DN2(DN2) U$23.2(2:IO1)
USB_DP: U$19.19:P914/USB_DP U$22.A6:DP1(DP1) U$22.B6:DP2(DP2) U$23.3(3:IO2)
USBLDO3V3: C18.2 U$19.20:VCC_USB
VBUS_5V2: D24.2(ANODE) U$22.A4,B9:VBUS(VBUS) U$22.B4,A9:VBUS(VBUS) U$23.4(4:VCC)
Unconnected: GPIO5,6,1.2(2:NC) GPIO5,6,1.4(4:PIN-C) GPIO5,6,1.6(6:PIN-B) GPIO5,6,2.2(2:NC) GPIO5,6,2.4(4:PIN-C) GPIO5,6,2.6(6:PIN-B) GPIO5,6,22.2(2:NC) GPIO5,6,22.4(4:PIN-C) GPIO5,6,22.6(6:PIN-B) I2C1.2(2:NC) I2C1.6(6:NC) I2C.2(2:NC) I2C.6(6:NC) I2S0(DAP4)1.6(6:I2S_OUT) IC2.5:LED2(LED2) IC2.6:LED3(LED3) IC2.7:LED4(LED4) IC2.8:LED5(LED5) IC2.9:LED6(LED6) IC2.10:LED7(LED7) IC2.12:LED8(LED8) IC2.13:LED9(LED9) IC2.14:LED10(LED10) IC2.15:LED11(LED11) IC2.16:LED12(LED12) IC2.17:LED13(LED13) IC2.18:LED14(LED14) IC2.19:LED15(LED15) LED4.2-DOUT(DOUT) LED13.A(ANODE) LED13.K(CATHODE) LED14.A(ANODE) LED14.K(CATHODE) R7.3 R7.4 R7.5 R7.6 R39.2 R42.2 U$13.5(5:NC) U$13.6(6:NC) U$13.12(12:NC) U$13.13(13:NC) U$19.1:P400 U$19.2:P401 U$19.3:P402 U$19.6:P215/XCIN U$19.7:P214/XCOUT U$19.12:P411 U$19.13:P410 U$19.14:P409 U$19.15:P408 U$19.22:P206 U$19.23:P205 U$19.24:P204 U$19.28:P304 U$19.29:P303 U$19.30:P302 U$19.31:P301 U$19.34:P109/TDO/SWO U$19.35:P110/TDI U$19.37:P112 U$19.38:P113 U$19.41:P107 U$19.43:P105 U$19.44:P104 U$19.52:P015 U$19.58:P011/VREFL0 U$19.60:P004 U$19.61:P003 U$19.62:P002 U$19.63:P001 U$19.64:P000 U$22.A8:SBU1(SBU1) U$22.B8:SBU2(SBU2) U$22.SHILED1 U$22.SHILED3 U$22.SHILED4 U$22.SHILED5(SHILED1) U$22.SHILED7(SHILED3) U$22.SHILED8(SHILED4)

## Notes on the sheet
- Revision | Jetson Nano 40Pin Header | SERIAL | I2S INPUT(MIC) | ServoControl | I2C LEVEL TRANSLATOR | SWD CONNECTOR
- OSCON 1000uF
- 初版 2022/07/11
- 0/ST
- Jetson ORIN Nano 40Pin
- 5V INLET
- 1/TH
- Jetson Nano | RA4M1
- TEST PIN | TEST PIN
- PCA9685BS
- 1.2 | 1.2 | 1.2
- GPIO | Full Color SPI LED LEVEL SHIFT | I2C(2Port) | I2S INTERNAL PCM Class D Amplifier(MONO) | SUBMCU | USB | SPI(For LCD)
- Open 9dB
- 4Way
- 3dB | 6dB | 15dB
- 12dB
- INTERNAL
- SPI2 | SPI2
- MONO
- lowPassFilter
- I2C | I2C | SPEAKER TERMINAL
- +
- MAFF1608
- MAFF1608 | -
- NotchFilter,ESD Protection
- INTERNAL
- AVRF060X100LT242
- AVRF060X100LT242
- 1.2 | 1.2 | 1.0.2
- LED | BUTTON

## Library data of the parts
A1 = FaBo-Capacitor:CAPACITOR-OS-CON: Panasonic 16SEPF1000M 16V 1000uF ESR 12 Size F13
C1-C20 = FaBo-Capacitor:CAPACITOR: CAPACITOR
CN1-CN5 = FaBo-PIN:PIN_1X1
CN6 = FaBo-PIN:PIN-HEADER-SMT(1.27MM)2X5
D1 D24 = FaBo-Diode:PMEG6020AELR
FB1 FB2 = FaBo-Coil:FERRITEBEADS
GPIO5,6,1 GPIO5,6,2 GPIO5,6,22 = FaBo-Connetor:MODULAR-JACK-6P-RJ11_GPIO3
I2C I2C1 = FaBo-Connetor:MODULAR-JACK-6P-RJ11_I2C
I2S0(DAP4)1 = FaBo-Connetor:MODULAR-JACK-6P-RJ11_I2S_MASTER
IC1 = FaBo-LevelTranslator:PCA9306
IC2 = FaBo-Motor:PCA9685BS
L1 L2 = FaBo-EMC:MAF1608F
LED0 LED1-LED4 = FaBo-LED:WS2812B_NARROW
LED5-LED14 = FaBo-LED:LED
M1 = FaBo-Mosfet:MOSFET-N
R1-R3 R6 R9 R10 R13-R42 = FaBo-Resistors:RESISTOR: RESISTOR
R4 R5 R8 R11 R12 = rcl:R-US_: RESISTOR, American symbol; SPICEPREFIX: R
R7 = component:RESISTOR_ARRAY
SPI2-0 SPI2-1 = FaBo-Connetor:MODULAR-JACK-6P-RJ11_SPI
ST ST1 = FaBo-Template:FABO_BRICK_3PIN: FaBo Brick 3pin
SW1 = FaBo-Switch:TACT-SWITCH: Part No Maker Datasheet Distributor 1273HA-160G-G SWITRONIC Catalog <http://www.switronic.com/uploads/images/A10.gif> Akizuki <http://akizukidenshi.com/catalog/g/gP-02561/> DTS-6-V Cosland DTS 6 Series <http://www.cosland.com/newproduct/DTS%20SERIES.pdf> Akizuki <http://akizukidenshi.com/catalog/g/gP-03647/> KMR2 C&K KMR2 SERIES <https://www.ckswitches.com/products/switches/product-details/Tactile/KMR2/> Octoparts Result <https://octopart.com/search?q=KMR2&start=0> TSHA-T-XB2-19E TOP UP INDUSTORY TSHA-T <http://www.top-up.com.tw/front/bin/ptdetail.phtml?Part=TSHA-T> Akizuki <http://akizukidenshi.com/catalog/g/gP-09361/>
T3 T4 = FaBo-Terminal:TBL004-508
U$11 U$12 = FaBo-Coil:AVRF060X100LT242: ESD Notch Filters For wireless audio equipment TDK AVRF series ESD protection and noise protechtion.
U$13 = FaBo-AudioIC:MAX98357A,B
U$14 = FaBo-PIN:2MMJUMPER_CROSS
U$18 = FaBo-Boards:JETSON_NANO
U$19 = FaBo-MPU:R7FA4M1AB3CFM
U$21 = FaBo-Crystal:CSTNE16M0V53L00ZR0: 3.2X1.3 16.0MHZ RESONA
U$22 = FaBo-USB:5077CR-16-SMC2-BK-TR
U$23 = FaBo-ESD:PRTR5V0U2X: Ultra low capacitance double rail to rail ESD protection diode
U$25 = FaBo-Diode:PMEG2010ER
U$28 = FaBo-BufferIC:74LVC1G125
UART2 = FaBo-Connetor:MODULAR-JACK-6P-RJ11_SERIAL_M_USART

## Board
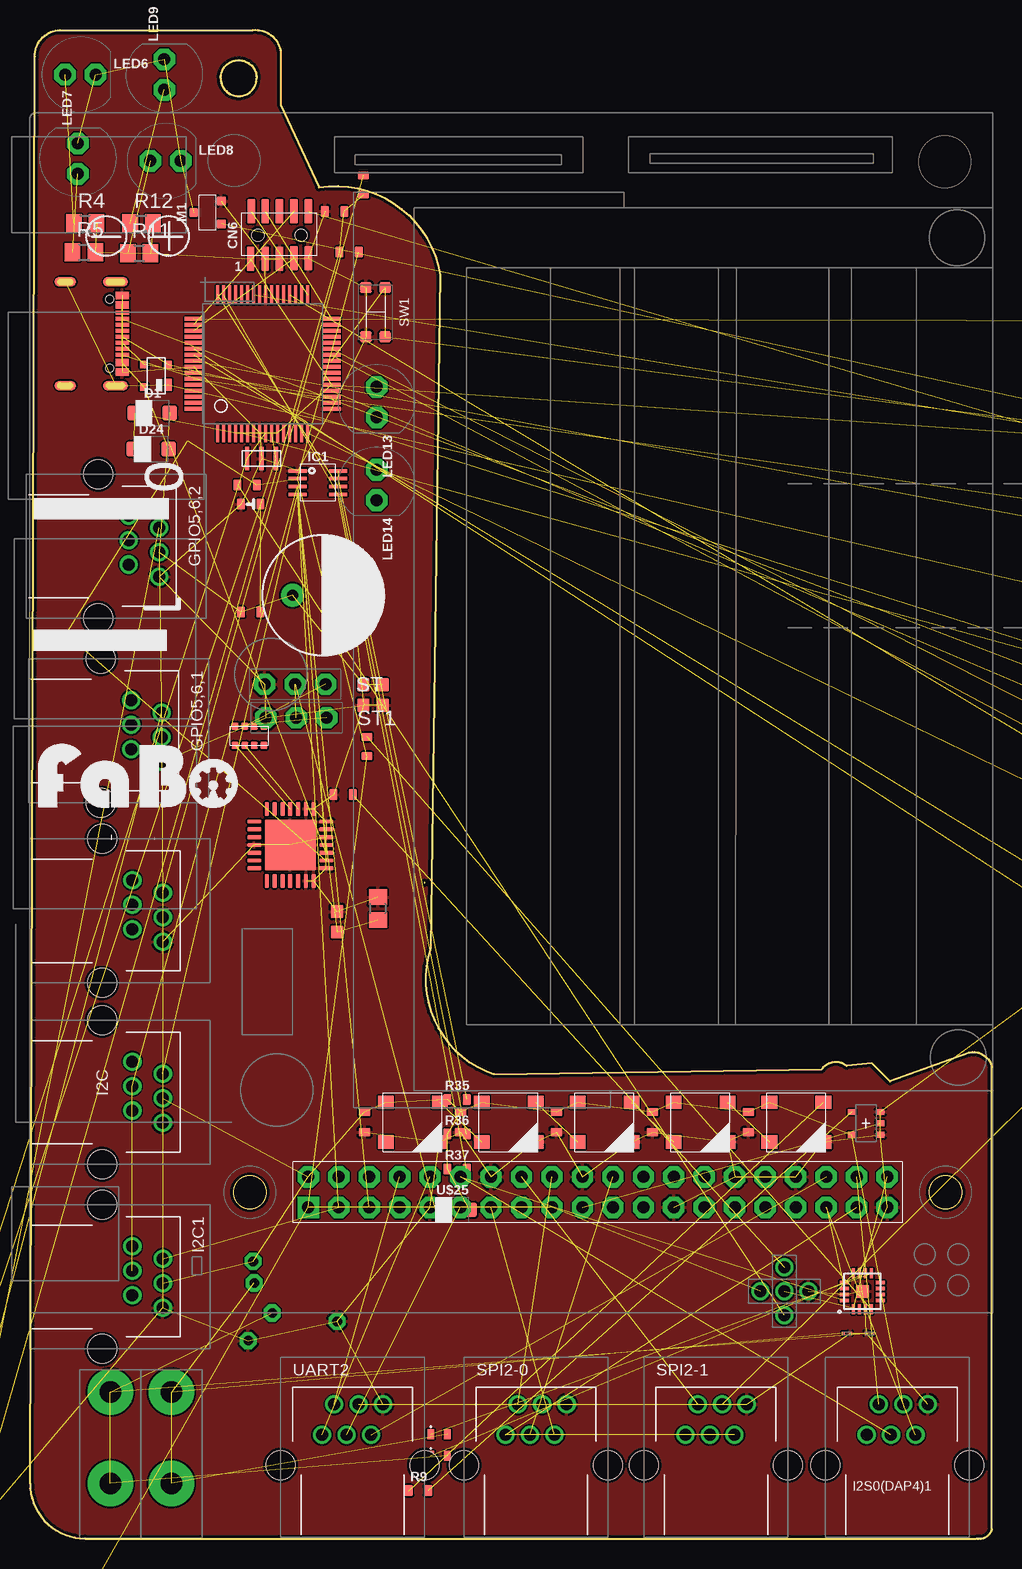
[diagram p9: board, top side]
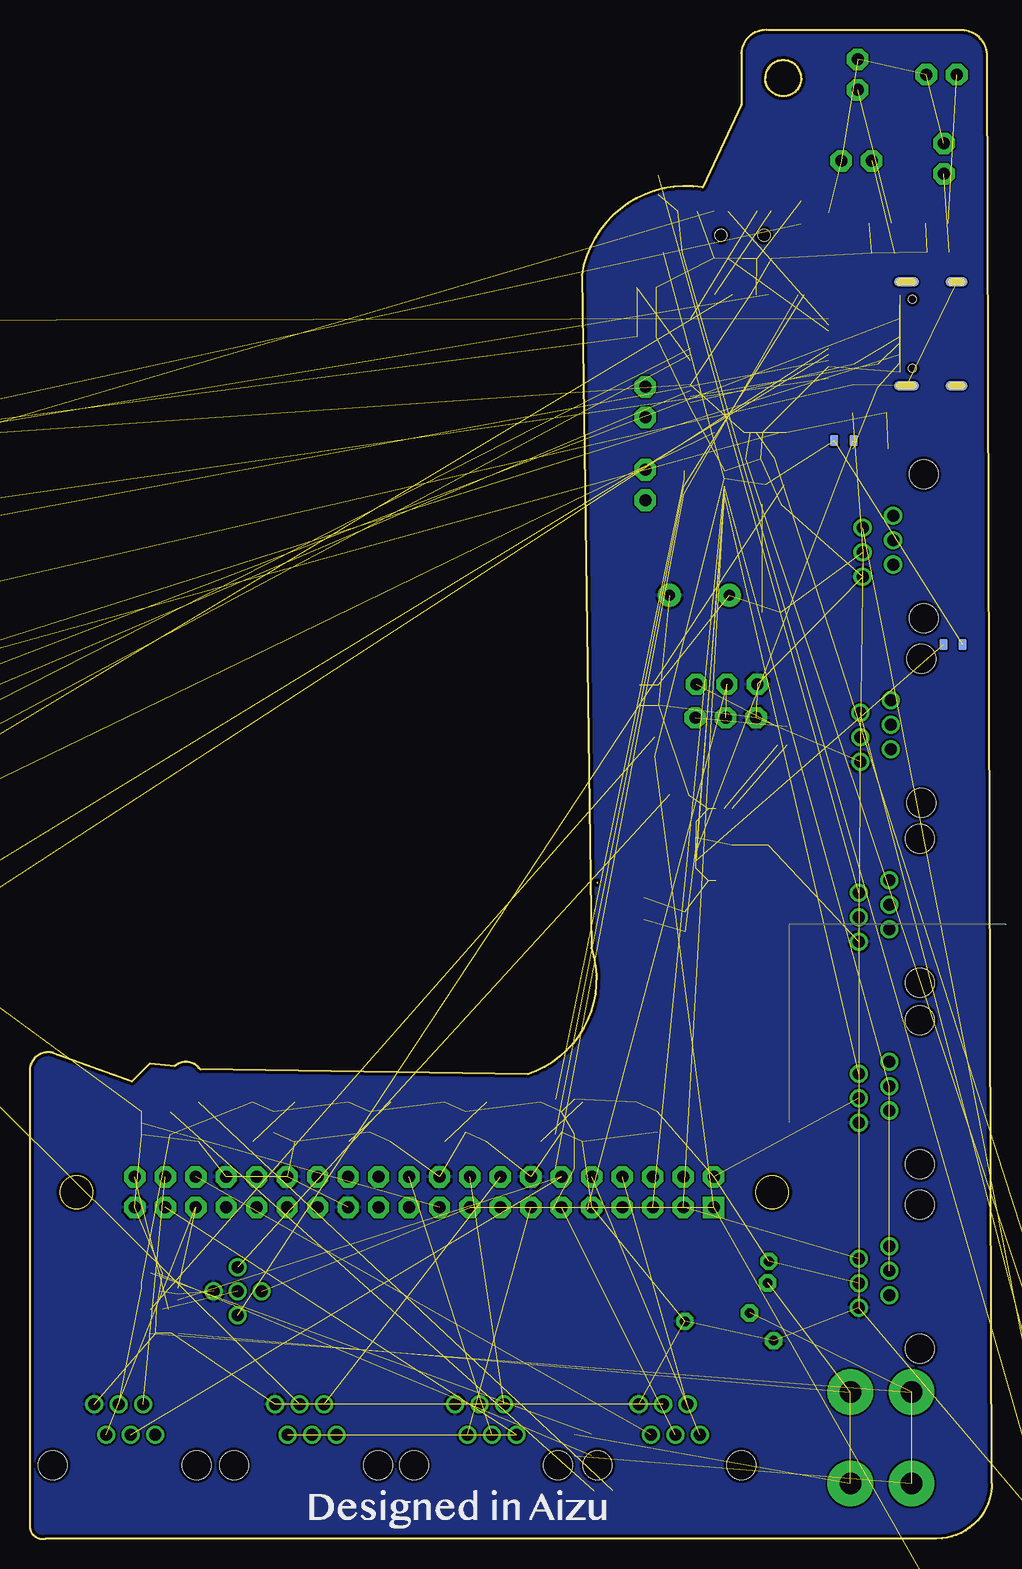
[diagram p10: board, bottom side, seen from below]

Size 80.2 x 125.74 mm. Coordinates in mm from the lower left corner, seen from the top.
Outline: 38.7,38.73 66,39.13 arc-96 68.1,39.43 70.2,39.63 71.7,38.13 78.3,40.53 arc-90 80.2,39.33 80.2,0.83 arc-90 78.9,0.03 4.6,0.03 arc-90 0,4.63 0.4,123.53 arc-90 2.5,125.73 18.6,125.73 arc-93 20.9,123.83 20.9,119.53 24.1,112.63 arc-90 34.2,105.33 33.4,49.23 arc90 38.7,38.73
Outline: 15.9,121.73 arc-180 18.9,121.73 arc-180 15.9,121.73
Copper layers (1*16): Top 0.035mm / dielectric 1.6mm / Bottom 0.035mm
Design rules "PCBway": minimum track width 6mil, minimum drill 12mil, track to track 6mil, track to pad 6mil, pad to pad 6mil, via to via 6mil, smd to smd 6mil, copper to edge 10mil, drill to drill 10mil, minimum pad ring 10mil, minimum via ring 6mil, stop-mask expansion 2mil, vias tented up to drill 100mil, thermal gap 8mil
tKeepout: area 14.4,-0.5 to 17.4,14.1

### Footprints (pad centres in the part's own frame; a part is rotated, then mirrored left to right if it is on the bottom)
F13 = drill 0.9 pad 1.93: ANODE -2.5,0; CATHODE 2.5,0
0603-NARROW = smd 0.71 x 1: 1 -0.85,0; 2 0.85,0
0603 = smd 1.1 x 1: 1 -0.85,0; 2 0.85,0
PIN_1X1_SMALL = drill 0.8 pad 1.422 octagon: 1 0,0
PIN-HEADER-SMT(1.27MM)2X5 = smd 0.635 x 2.032: 1 -2.4,-1.95; 2 -2.35,2; 3 -1.2,-1.95; 4 -1.2,2; 5 0,-1.95; 6 0,2; 7 1.2,-1.9; 8 1.2,2; 9 2.4,-1.9; 10 2.4,2 | hole 1: 1.8,0; -1.8,0
SOD123W = smd 1.2 x 1.2: 1 -1.45,0; 2 1.45,0
0603' = smd 0.65 x 0.9: 1 -0.8,0; 2 0.8,0
7002-6PXC-X = drill 1: 1 2.55,5.08; 2 1.53,2.54; 3 0.51,5.08; 4 -0.51,2.54; 5 -1.53,5.08; 6 -2.55,2.54 | hole 2.4: -6,0; 6,0
8PIN-SSOP = smd 0.3 x 1.6: 1 -0.975,-1.7; 2 -0.325,-1.7; 3 0.325,-1.7; 4 0.975,-1.7; 5 0.975,1.7; 6 0.325,1.7; 7 -0.325,1.7; 8 -0.975,1.7
HVQFN28 = smd 1.2 x 0.38: 1:A3 -3,1.95; 2:A4 -3,1.3; 3:LED0 -3,0.65; 4:LED1 -3,0; 5:LED2 -3,-0.65; 6:LED3 -3,-1.3; 7:LED4 -3,-1.95; 15:LED11 3,-1.95; 16:LED12 3,-1.3; 17:LED13 3,-0.65; 18:LED14 3,0; 19:LED15 3,0.65; 20:OE 3,1.3; 21:A5 3,1.95 | smd 0.38 x 1.2: 8:LED5 -1.95,-3; 9:LED6 -1.3,-3; 10:LED7 -0.65,-3; 11:VSS 0,-3; 12:LED8 0.65,-3; 13:LED9 1.3,-3; 14:LED10 1.95,-3; 22:EXTCLK 1.95,3; 23:SCL 1.3,3; 24:SDA 0.65,3; 25:VDD 0,3; 26:A0 -0.65,3; 27:A1 -1.3,3; 28:A2 -1.95,3 | smd 4.25 x 4.25: 29 0,0
1608MM = smd 0.6 x 0.8: 1 -0.7,0; 2 0.7,0
WS2812B_NARROW = smd 1.3 x 1.1: 1-VDD -2.25,1.65; 2-DOUT -2.25,-1.65; 3-VSS 2.25,-1.65; 4-DIN 2.25,1.65
0603'' = smd 0.65 x 0.9: ANODE -0.8,0; CATHODE 0.8,0
LED_5MM = drill 1 pad 1.8 octagon: A -1.27,0; K 1.27,0
SUPERSOT-3 = smd 0.76 x 0.76: D 0,1.15; G -0.95,-1.15; S 0.95,-1.15
R0805 = smd 1.3 x 1.5: 1 -0.95,0; 2 0.95,0
EXBV8V = smd 0.6 x 0.6: 1 -1.2,-0.8; 2 -0.4,-0.8; 3 0.4,-0.8; 4 1.2,-0.8; 5 1.2,0.8; 6 0.4,0.8; 7 -0.4,0.8; 8 -1.2,0.8
FABO_BRICK_3PIN_HEADER = drill 1 pad 1.778 octagon: GND -2.54,0; I/O 2.54,0; VCC 0,0
KMR2 = smd 0.9 x 1: 1 -2.05,0.8; 2 2.05,0.8; 3 2.05,-0.8; 4 -2.05,-0.8
TBL004-508 = drill 1.8 pad 3.81: P$1 0,3.81; P$2 0,-3.81
AVRF0X0X100LT_0603 = smd 0.25 x 0.3: 1 -0.275,0; 2 0.275,0
TQFN(16L3*3*0.75) = smd 0.28 x 0.8: 1 -0.75,-1.5; 2 -0.25,-1.5; 3 0.25,-1.5; 4 0.75,-1.5; 9 0.75,1.5; 10 0.25,1.5; 11 -0.25,1.5; 12 -0.75,1.5 | smd 0.8 x 0.28: 5 1.5,-0.75; 6 1.5,-0.25; 7 1.5,0.25; 8 1.5,0.75; 13 -1.5,0.75; 14 -1.5,0.25; 15 -1.5,-0.25; 16 -1.5,-0.75 | smd 1.1 x 1.1: 17 0,0
PINHEAD2MM_CROSS = drill 1: 1 0,0; 2 -2,0; 3 0,2; 4 2,0; 5 0,-2
JETSON_NANO_DEMENTION = drill 1 pad 1.778 square: 1 0,0 | drill 1 pad 1.778 octagon: 2 0,2.54; 3 2.54,0; 4 2.54,2.54; 5 5.08,0; 6 5.08,2.54; 7 7.62,0; 8 7.62,2.54; 9 10.16,0; 10 10.16,2.54; 11 12.7,0; 12 12.7,2.54; 13 15.24,0; 14 15.24,2.54; 15 17.78,0; 16 17.78,2.54; 17 20.32,0; 18 20.32,2.54; 19 22.86,0; 20 22.86,2.54; 21 25.4,0; 22 25.4,2.54; 23 27.94,0; 24 27.94,2.54; 25 30.48,0; 26 30.48,2.54; 27 33.02,0; 28 33.02,2.54; 29 35.56,0; 30 35.56,2.54; 31 38.1,0; 32 38.1,2.54; 33 40.64,0; 34 40.64,2.54; 35 43.18,0; 36 43.18,2.54; 37 45.72,0; 38 45.72,2.54; 39 48.26,0; 40 48.26,2.54
LQFP-64_RENESAS = smd 0.28 x 1.5: 1:P400 -3.75,-5.75; 2:P401 -3.25,-5.75; 3:P402 -2.75,-5.75; 4:VBATT -2.25,-5.75; 5:VCL -1.75,-5.75; 6:P215/XCIN -1.25,-5.75; 7:P214/XCOUT -0.75,-5.75; 8:VSS -0.25,-5.75; 9:P213/XTAL 0.25,-5.75; 10:P212/EXTAL 0.75,-5.75; 11:VCC 1.25,-5.75; 12:P411 1.75,-5.75; 13:P410 2.25,-5.75; 14:P409 2.75,-5.75; 15:P408 3.25,-5.75; 16:P407 3.75,-5.75; 33:P108/TMS/SWDIO 3.75,5.75; 34:P109/TDO/SWO 3.25,5.75; 35:P110/TDI 2.75,5.75; 36:P111 2.25,5.75; 37:P112 1.75,5.75; 38:P113 1.25,5.75; 39:VCC 0.75,5.75; 40:VSS 0.25,5.75; 41:P107 -0.25,5.75; 42:P106 -0.75,5.75; 43:P105 -1.25,5.75; 44:P104 -1.75,5.75; 45:P103 -2.25,5.75; 46:P102 -2.75,5.75; 47:P101 -3.25,5.75; 48:P100 -3.75,5.75 | smd 1.5 x 0.28: 17:VSS_USB 5.75,-3.75; 18:P915/USB_DM 5.75,-3.25; 19:P914/USB_DP 5.75,-2.75; 20:VCC_USB 5.75,-2.25; 21:VCC_USB_LDO 5.75,-1.75; 22:P206 5.75,-1.25; 23:P205 5.75,-0.75; 24:P204 5.75,-0.25; 25:RES 5.75,0.25; 26:P201/MD 5.75,0.75; 27:P200 5.75,1.25; 28:P304 5.75,1.75; 29:P303 5.75,2.25; 30:P302 5.75,2.75; 31:P301 5.75,3.25; 32:P300/TCK/SWCLK 5.75,3.75; 49:P500 -5.75,3.75; 50:P501 -5.75,3.25; 51:P502 -5.75,2.75; 52:P015 -5.75,2.25; 53:P014 -5.75,1.75; 54:P013/VREFL -5.75,1.25; 55:P012/VREFH -5.75,0.75; 56:AVCC0 -5.75,0.25; 57:AVSS0 -5.75,-0.25; 58:P011/VREFL0 -5.75,-0.75; 59:P010/VREFH0 -5.75,-1.25; 60:P004 -5.75,-1.75; 61:P003 -5.75,-2.25; 62:P002 -5.75,-2.75; 63:P001 -5.75,-3.25; 64:P000 -5.75,-3.75
3-SMD = smd 0.4 x 1.9: 1:INPUT 1.2,0; 2:GND 0,0; 3:OUTPUT -1.2,0
5077CR-16-SMC2-BK-TR = smd 0.6 x 1.14: A1,B12:GND -3.2,0; A4,B9:VBUS -2.4,0; B1,A12:GND 3.2,0; B4,A9:VBUS 2.4,0 | smd 0.3 x 1.14: A5:CC1 -1.25,0; A6:DP1 -0.25,0; A7:DN1 0.25,0; A8:SBU1 1.25,0; B5:CC2 1.75,0; B6:DP2 0.75,0; B7:DN2 -0.75,0; B8:SBU2 -1.75,0 | smd 0.8 x 2.1: SHILED1 -4.32,-0.57; SHILED2 4.32,-0.57 | smd 0.8 x 1.8: SHILED3 -4.32,-4.75; SHILED4 4.32,-4.75 | smd 0.8 x 2.1 bottom: SHILED5 -4.32,-0.57; SHILED7 4.32,-0.57 | smd 0.8 x 1.8 bottom: SHILED6 -4.32,-4.75; SHILED8 4.32,-4.75 | hole 0.65: -2.89,-1.07; 2.89,-1.07
SOT143B = smd 1 x 0.7: 1 -0.75,-1 | smd 0.6 x 0.7: 2 0.95,-1; 3 0.95,1; 4 -0.95,1
TSOP5(SOT753) = smd 0.7 x 0.45: 1 1.2,-0.95; 2 1.2,0; 3 1.2,0.95; 4 -1.2,0.95; 5 -1.2,-0.95

### Placement (x,y rotation side)
A1  24.4,78.63 0 top
C1  35.9,34.73 90 top
C2  43.9,34.73 90 top
C3  51.9,34.73 90 top
C4  59.9,34.73 90 top
C5  27.9,34.73 90 top
C6  27.8,70.33 90 top
C7  114.8,73.23 0 top  (outside the outline)
C8  29.4,70.33 90 top
C9  -15.9,-13.47 0 top  (outside the outline)
C10  114.8,70.23 0 top  (outside the outline)
C11  114.8,65.13 0 top  (outside the outline)
C12  114.8,62.13 0 top  (outside the outline)
C13  114.8,59.13 0 top  (outside the outline)
C14  114.8,56.13 0 top  (outside the outline)
C15  25.6,51.43 270 top
C16  98.5,88.13 0 top  (outside the outline)
C17  98.5,73.33 0 top  (outside the outline)
C18  97.6,64.53 0 top  (outside the outline)
C19  97.6,61.53 0 top  (outside the outline)
C20  -15.9,-16.47 0 top  (outside the outline)
CN1  18.2,16.53 0 top
CN2  25.6,18.13 0 top
CN3  18.6,23.13 0 top
CN4  18.7,21.33 0 top
CN5  20.2,18.83 0 top
CN6  20.8,108.63 0 top
D1  10.2,93.83 0 top
D24  10.1,90.83 0 top
FB1  [0603']  114.8,82.03 0 top  (outside the outline)
FB2  [0603']  114.8,79.13 0 top  (outside the outline)
GPIO5,6,1  5.9,67.33 270 top
GPIO5,6,2  5.7,82.73 270 top
GPIO5,6,22  6,52.33 270 top
I2C  6,37.23 270 top
I2C1  6,21.83 270 top
I2S0(DAP4)1  72.3,6.13 0 top
IC1  24,88.03 270 top
IC2  21.7,57.83 270 top
L1  34.1,8.73 0 top
L2  34.1,6.93 0 top
LED0  63.9,34.73 0 top
LED1  55.9,34.73 0 top
LED2  47.9,34.73 0 top
LED3  39.9,34.73 0 top
LED4  31.9,34.73 0 top
LED5  [0603'']  18.4,86.23 180 top
LED6  4.2,122.03 0 top
LED7  4,115.03 90 top
LED8  11.3,114.83 0 top
LED9  11.2,122.03 90 top
LED10  [0603'']  97.6,58.63 0 top  (outside the outline)
LED11  [0603'']  97.6,52.83 0 top  (outside the outline)
LED12  [0603'']  97.6,49.93 0 top  (outside the outline)
LED13  28.9,94.73 270 top
LED14  28.9,87.83 270 top
M1  14.8,110.53 90 top
R1  0  [0603']  27.8,112.83 90 top
R2  DNP  [0603']  25.4,110.63 180 top
R3  DNP  [0603']  26.6,107.23 180 top
R4  4.6,109.63 0 top
R5  4.5,107.23 0 top
R6  634K  [0603']  28.1,66.03 90 top
R7  18.3,66.93 0 top
R8  29,52.53 270 top
R9  0  [0603']  32.4,4.03 0 top
R10  0  [0603']  -17,-34.57 0 top  (outside the outline)
R11  9.1,107.13 0 top
R12  9.3,109.63 0 top
R13  220  [0603']  114.8,87.83 0 top  (outside the outline)
R14  10K  [0603']  114.8,84.93 0 top  (outside the outline)
R15  5.1K  [0603']  114.8,76.23 0 top  (outside the outline)
R16  5.1K  [0603']  114.8,53.23 0 top  (outside the outline)
R17  100K  [0603']  18.1,87.83 180 top
R18  100K  [0603']  26.1,62.03 180 top
R19  5.1K  [0603']  114.8,50.33 0 top  (outside the outline)
R20  5.1K  [0603']  114.8,47.43 0 top  (outside the outline)
R21  1K  [0603']  18.4,77.23 180 top
R22  DFN  [0603']  3.25,74.53 0 bottom
R23  DFN  [0603']  12.35,91.53 180 bottom
R24  5.1K  [0603']  98.7,107.33 0 top  (outside the outline)
R25  5.1K  [0603']  98.7,104.43 0 top  (outside the outline)
R26  100K1%  [0603']  98.7,101.53 0 top  (outside the outline)
R27  13.7K1%  [0603']  98.7,98.63 0 top  (outside the outline)
R28  5.1K  [0603']  98.5,91.13 0 top  (outside the outline)
R29  5.1K  [0603']  98.5,76.33 0 top  (outside the outline)
R30  5.1K  [0603']  97.6,70.43 0 top  (outside the outline)
R31  5.1K  [0603']  97.6,67.53 0 top  (outside the outline)
R32  330  [0603']  97.6,55.73 0 top  (outside the outline)
R33  330  [0603']  97.6,47.03 0 top  (outside the outline)
R34  330  [0603']  97.6,44.13 0 top  (outside the outline)
R35  200K  [0603']  35.6,36.63 0 top
R36  5.1K  [0603']  35.6,33.73 0 top
R37  5.1K  [0603']  35.6,30.83 0 top
R38  DNP  [0603']  -14.2,-34.57 0 top  (outside the outline)
R39  DNP  [0603']  -11.4,-34.57 0 top  (outside the outline)
R40  0  [0603']  -17,-52.67 0 top  (outside the outline)
R41  DNP  [0603']  -14.2,-52.67 0 top  (outside the outline)
R42  DNP  [0603']  -11.4,-52.67 0 top  (outside the outline)
SPI2-0  42.2,6.13 0 top
SPI2-1  57.2,6.13 0 top
ST  22.1,71.23 0 top
ST1  22.2,68.43 0 top
SW1  28.8,102.23 270 top
T3  11.8,8.43 0 top
T4  6.7,8.43 0 top
U$11  68.1,17.13 0 top
U$12  70,17.13 180 top
U$13  69.4,20.63 0 top
U$14  62.9,20.63 90 top
U$17  [LOGO_FABO_L]  8.3,60.93 0 top
U$18  23.2,27.63 0 top
U$19  19.4,97.93 0 top
U$21  19.3,90.03 180 top
U$22  7.7,100.43 270 top
U$23  10.5,96.93 90 top
U$25  35.2,27.43 0 top
U$28  69.7,34.63 0 top
UART2  26.9,6.13 0 top

### Tracks (layer width: path | path; a pad name or v marks a point on that pad's centre or on a via)
3DB  (1 unrouted)
3V3  (2 unrouted)
5V  (26 unrouted)
15DB  (1 unrouted)
AREF  (1 unrouted)
G1  (1 unrouted)
G2  (1 unrouted)
G6  (1 unrouted)
GAIN  (1 unrouted)
GND  (91 unrouted)
  pour Top (rank 6): -16.3,127.63 84,127.63 84,-9.07 -16.3,-9.07
  pour Bottom (rank 6): -18.4,128.93 85.9,128.93 85.9,-11.37 -18.4,-11.37
GPIO2/SDA1  (5 unrouted)
GPIO3/SCL1  (5 unrouted)
GPIO6  (6 unrouted)
GPIO10/SPI1_MOSI  (1 unrouted)
GPIO14/TXD  (1 unrouted)
GPIO15/RXD  (1 unrouted)
GPIO16/UART2_CTS  (1 unrouted)
GPIO17/UART2_RTS  (1 unrouted)
GPIO18/I2S0_SCLK  (2 unrouted)
GPIO19/I2S0_FS  (2 unrouted)
GPIO20/I2S0_DIN  (1 unrouted)
GPIO21/I2S0_DOUT  (1 unrouted)
GPIO23/SPI2_CS1  (1 unrouted)
GPIO24/SPI2_CS0  (1 unrouted)
GPIO25/SPI2_MISO  (2 unrouted)
GPIO26/SPI2_MOSI  (2 unrouted)
GPIO27/SPI2_SCK  (2 unrouted)
JETSON3V3  (10 unrouted)
JETSON　5V  (29 unrouted)
MONO  (1 unrouted)
N$1  (1 unrouted)
N$2  (1 unrouted)
N$3  (1 unrouted)
N$4  (1 unrouted)
N$5  (1 unrouted)
N$6  (1 unrouted)
N$7  (1 unrouted)
N$8  (1 unrouted)
N$9  (1 unrouted)
N$10  (1 unrouted)
N$11  (4 unrouted)
N$12  (1 unrouted)
N$13  (1 unrouted)
N$14  (2 unrouted)
N$15  (1 unrouted)
N$16  (1 unrouted)
N$17  (1 unrouted)
N$18  (2 unrouted)
N$19  (2 unrouted)
N$20  (2 unrouted)
N$21  (2 unrouted)
N$22  (1 unrouted)
N$23  (1 unrouted)
N$24  (1 unrouted)
N$25  (1 unrouted)
N$26  (2 unrouted)
N$27  (2 unrouted)
N$28  (2 unrouted)
N$29  (1 unrouted)
N$30  (1 unrouted)
N$31  (1 unrouted)
N$32  (1 unrouted)
N$33  (1 unrouted)
N$34  (1 unrouted)
N$35  (1 unrouted)
N$36  (1 unrouted)
N$37  (1 unrouted)
N$38  (2 unrouted)
OUTN  (1 unrouted)
OUTP  (1 unrouted)
RA4_SCL_5V  (2 unrouted)
RA4_SDA_5V  (2 unrouted)
RESET  (5 unrouted)
SCII_RXD  (1 unrouted)
SCII_TXD  (1 unrouted)
SHILED  (4 unrouted)
SP_MINUS  (4 unrouted)
SP_PLUS  (4 unrouted)
SWDCLK  (1 unrouted)
SWDIO  (1 unrouted)
USB_DN  (3 unrouted)
USB_DP  (3 unrouted)
USBLDO3V3  (1 unrouted)
VBUS_5V2  (3 unrouted)

### Text on the board
Document: InfraRed OUT / 4Way | USB RA4M1 | 38kHz IR | InfraRed OUT / Upper | PCA9685 / SG-90 / RC Car | GPIO6 | I 2C | I 2C | #519 Jetson Nano / Rev2.1.0 / 2023/07/28 | SERIAL | SPI2-0 | SPI2-1 | I2S-MIC | SPEAKER